# Altium project Jetson AGX Xavier Carrier Board.PrjPcb (part 5 of 8)

## Sheet JETSON AGX SDIO-SPI-UART-CAN-GPIO.SchDoc: Jetson AGX SDIO-SPI-UART-CAN-GPIO
size 431 x 279 mm; CheckedBy: Lance Bantoto; Engineer: Cindy Li, Chealsie Bains; DocumentNumber: 7; Revision: 1; SheetNumber: 7; SheetTotal: 23
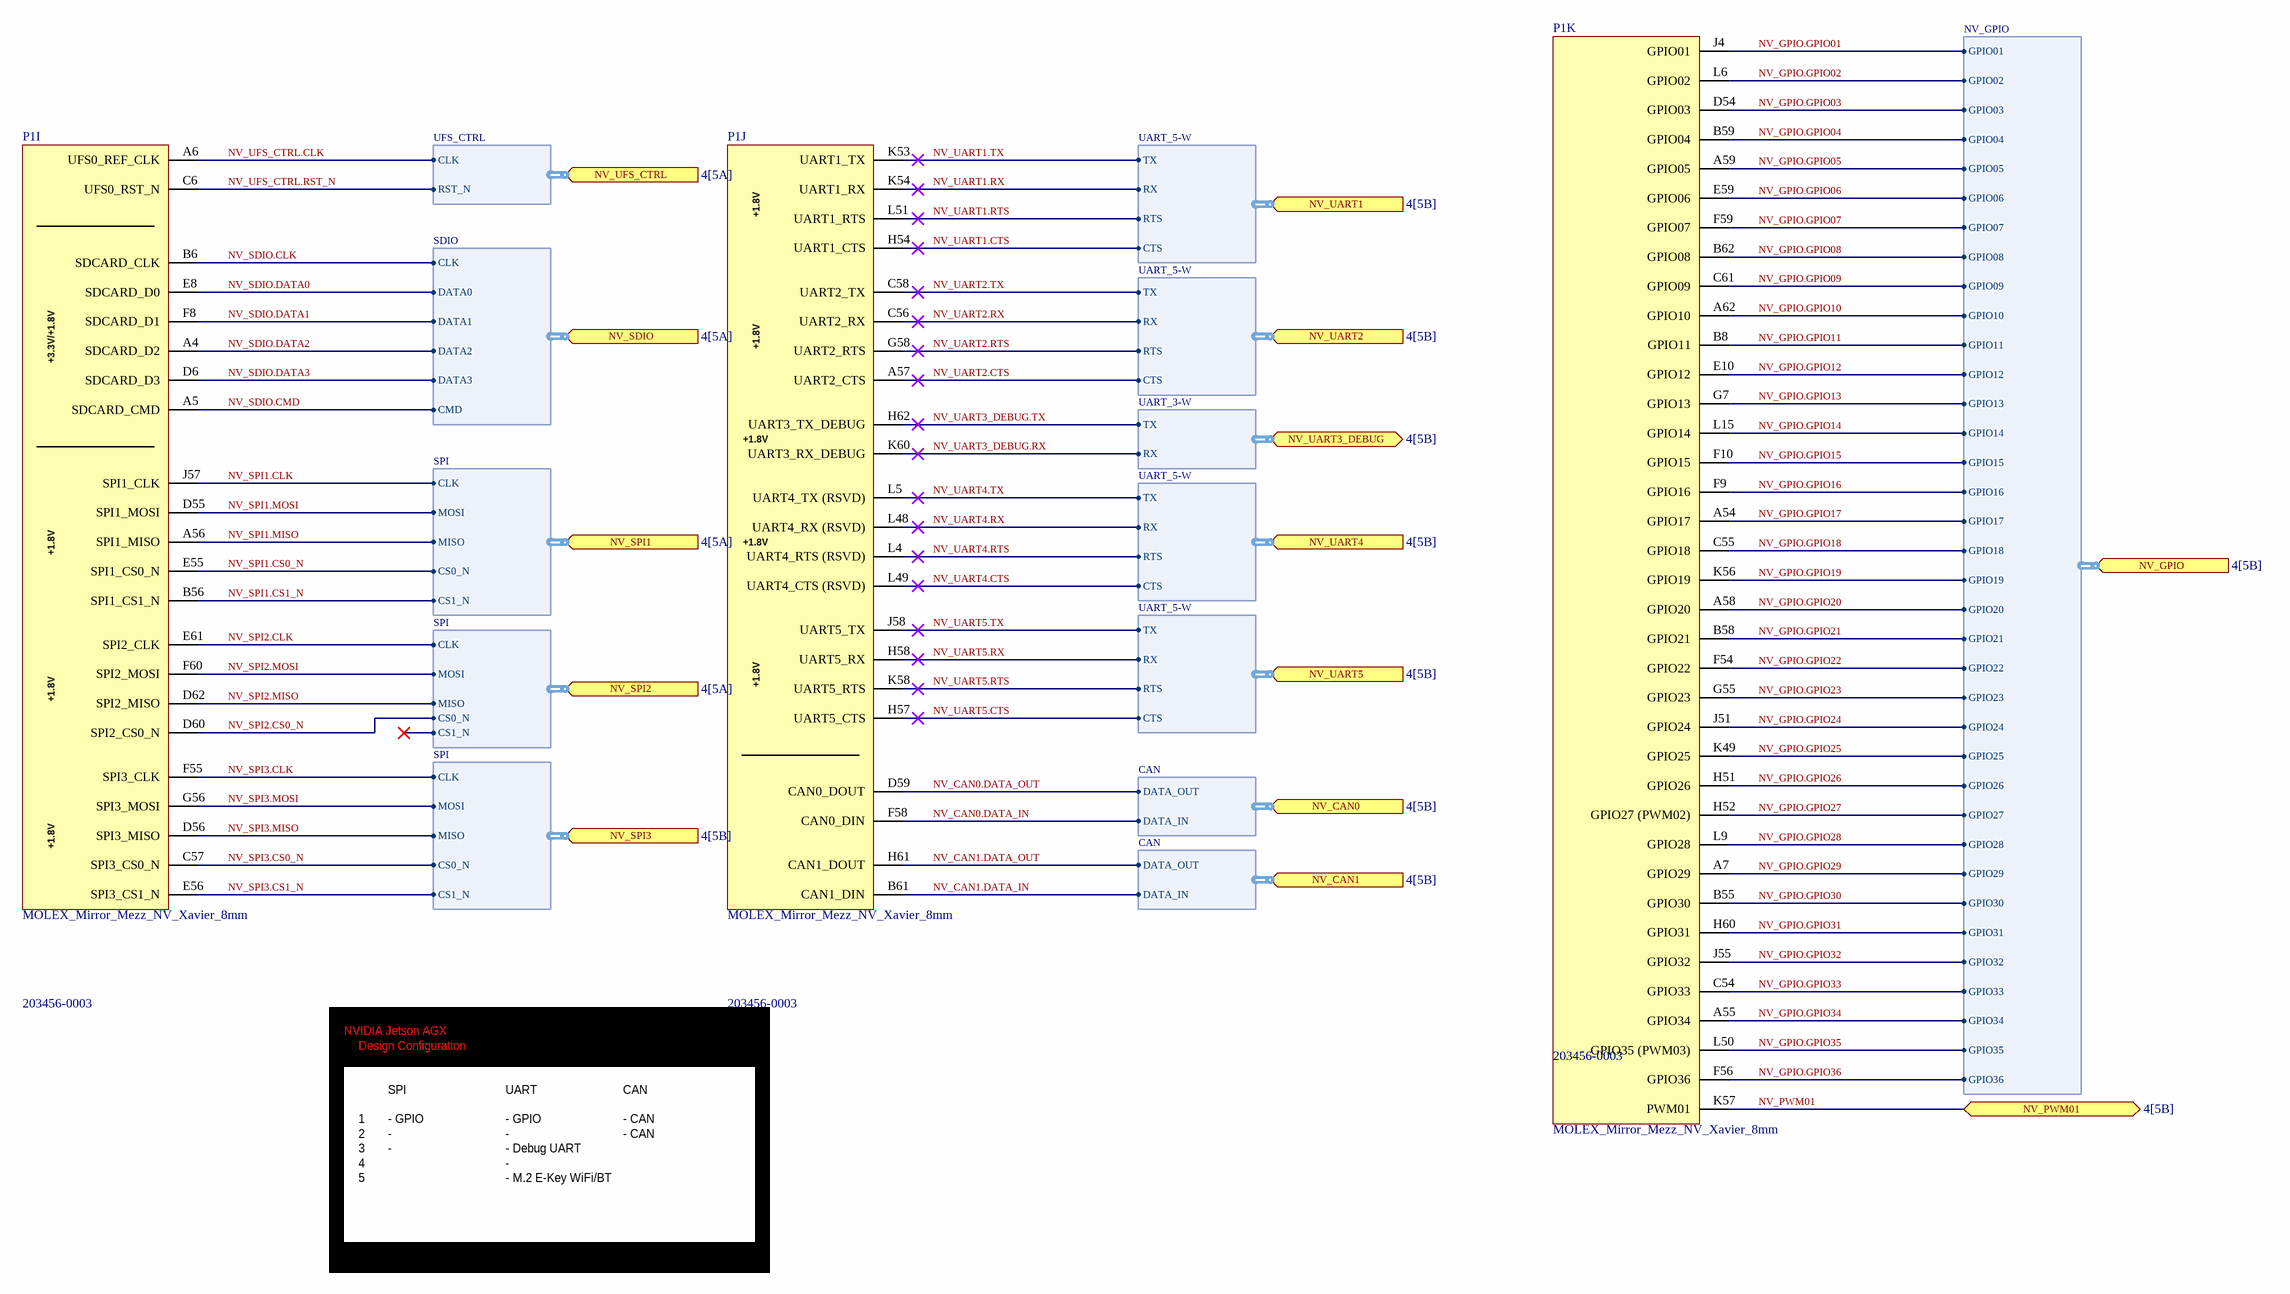
[diagram p14: JETSON AGX SDIO-SPI-UART-CAN-GPIO.SchDoc]

### Parts
P1  MOLEX_Mirror_Mezz_NV_Xavier_8mm  [203456-0003]  (parts I,J,K of 15)

### Ports
NV_CAN0 (in, harness CAN, see 4[5B]), NV_CAN1 (in, harness CAN, see 4[5B]), NV_GPIO (in, harness NV_GPIO, see 4[5B]), NV_PWM01 (bidir, see 4[5B]), NV_SDIO (in, harness SDIO, see 4[5A]), NV_SPI1 (in, harness SPI, see 4[5A]), NV_SPI2 (in, harness SPI, see 4[5A]), NV_SPI3 (in, harness SPI, see 4[5B]), NV_UART1 (in, harness UART_5-W, see 4[5B]), NV_UART2 (in, harness UART_5-W, see 4[5B]), NV_UART3_DEBUG (bidir, harness UART_3-W, see 4[5B]), NV_UART4 (in, harness UART_5-W, see 4[5B]), NV_UART5 (in, harness UART_5-W, see 4[5B]), NV_UFS_CTRL (in, harness UFS_CTRL, see 4[5A])

### Harnesses
SDIO: CLK, DATA0, DATA1, DATA2, DATA3, CMD
SPI: CLK, MOSI, MISO, CS0_N, CS1_N
UFS_CTRL: CLK, RST_N
UART_5-W: TX, RX, RTS, CTS
UART_3-W: TX, RX
CAN: DATA_OUT, DATA_IN
NV_GPIO: GPIO01, GPIO02, GPIO03, GPIO04, GPIO05, GPIO06, GPIO07, GPIO08, GPIO09, GPIO10, GPIO11, GPIO12, GPIO13, GPIO14, GPIO15, GPIO16, GPIO17, GPIO18, GPIO19, GPIO20, GPIO21, GPIO22, GPIO23, GPIO24, GPIO25, GPIO26, GPIO27, GPIO28, GPIO29, GPIO30, GPIO31, GPIO32, GPIO33, GPIO34, GPIO35, GPIO36

### Nets
NV_CAN0.DATA_IN: P1.F58(CAN0_DIN) ; port NV_CAN0.DATA_IN
NV_CAN0.DATA_OUT: P1.D59(CAN0_DOUT) ; port NV_CAN0.DATA_OUT
NV_CAN1.DATA_IN: P1.B61(CAN1_DIN) ; port NV_CAN1.DATA_IN
NV_CAN1.DATA_OUT: P1.H61(CAN1_DOUT) ; port NV_CAN1.DATA_OUT
NV_GPIO.GPIO01: P1.J4(GPIO01) ; port NV_GPIO.GPIO01
NV_GPIO.GPIO02: P1.L6(GPIO02) ; port NV_GPIO.GPIO02
NV_GPIO.GPIO03: P1.D54(GPIO03) ; port NV_GPIO.GPIO03
NV_GPIO.GPIO04: P1.B59(GPIO04) ; port NV_GPIO.GPIO04
NV_GPIO.GPIO05: P1.A59(GPIO05) ; port NV_GPIO.GPIO05
NV_GPIO.GPIO06: P1.E59(GPIO06) ; port NV_GPIO.GPIO06
NV_GPIO.GPIO07: P1.F59(GPIO07) ; port NV_GPIO.GPIO07
NV_GPIO.GPIO08: P1.B62(GPIO08) ; port NV_GPIO.GPIO08
NV_GPIO.GPIO09: P1.C61(GPIO09) ; port NV_GPIO.GPIO09
NV_GPIO.GPIO10: P1.A62(GPIO10) ; port NV_GPIO.GPIO10
NV_GPIO.GPIO11: P1.B8(GPIO11) ; port NV_GPIO.GPIO11
NV_GPIO.GPIO12: P1.E10(GPIO12) ; port NV_GPIO.GPIO12
NV_GPIO.GPIO13: P1.G7(GPIO13) ; port NV_GPIO.GPIO13
NV_GPIO.GPIO14: P1.L15(GPIO14) ; port NV_GPIO.GPIO14
NV_GPIO.GPIO15: P1.F10(GPIO15) ; port NV_GPIO.GPIO15
NV_GPIO.GPIO16: P1.F9(GPIO16) ; port NV_GPIO.GPIO16
NV_GPIO.GPIO17: P1.A54(GPIO17) ; port NV_GPIO.GPIO17
NV_GPIO.GPIO18: P1.C55(GPIO18) ; port NV_GPIO.GPIO18
NV_GPIO.GPIO19: P1.K56(GPIO19) ; port NV_GPIO.GPIO19
NV_GPIO.GPIO20: P1.A58(GPIO20) ; port NV_GPIO.GPIO20
NV_GPIO.GPIO21: P1.B58(GPIO21) ; port NV_GPIO.GPIO21
NV_GPIO.GPIO22: P1.F54(GPIO22) ; port NV_GPIO.GPIO22
NV_GPIO.GPIO23: P1.G55(GPIO23) ; port NV_GPIO.GPIO23
NV_GPIO.GPIO24: P1.J51(GPIO24) ; port NV_GPIO.GPIO24
NV_GPIO.GPIO25: P1.K49(GPIO25) ; port NV_GPIO.GPIO25
NV_GPIO.GPIO26: P1.H51(GPIO26) ; port NV_GPIO.GPIO26
NV_GPIO.GPIO27: P1.H52(GPIO27_(PWM02)) ; port NV_GPIO.GPIO27
NV_GPIO.GPIO28: P1.L9(GPIO28) ; port NV_GPIO.GPIO28
NV_GPIO.GPIO29: P1.A7(GPIO29) ; port NV_GPIO.GPIO29
NV_GPIO.GPIO30: P1.B55(GPIO30) ; port NV_GPIO.GPIO30
NV_GPIO.GPIO31: P1.H60(GPIO31) ; port NV_GPIO.GPIO31
NV_GPIO.GPIO32: P1.J55(GPIO32) ; port NV_GPIO.GPIO32
NV_GPIO.GPIO33: P1.C54(GPIO33) ; port NV_GPIO.GPIO33
NV_GPIO.GPIO34: P1.A55(GPIO34) ; port NV_GPIO.GPIO34
NV_GPIO.GPIO35: P1.L50(GPIO35_(PWM03)) ; port NV_GPIO.GPIO35
NV_GPIO.GPIO36: P1.F56(GPIO36) ; port NV_GPIO.GPIO36
NV_PWM01: P1.K57(PWM01) ; port NV_PWM01
NV_SDIO.CLK: P1.B6(SDCARD_CLK) ; port NV_SDIO.CLK
NV_SDIO.CMD: P1.A5(SDCARD_CMD) ; port NV_SDIO.CMD
NV_SDIO.DATA0: P1.E8(SDCARD_D0) ; port NV_SDIO.DATA0
NV_SDIO.DATA1: P1.F8(SDCARD_D1) ; port NV_SDIO.DATA1
NV_SDIO.DATA2: P1.A4(SDCARD_D2) ; port NV_SDIO.DATA2
NV_SDIO.DATA3: P1.D6(SDCARD_D3) ; port NV_SDIO.DATA3
NV_SPI1.CLK: P1.J57(SPI1_CLK) ; port NV_SPI1.CLK
NV_SPI1.CS0_N: P1.E55(SPI1_CS0_N) ; port NV_SPI1.CS0_N
NV_SPI1.CS1_N: P1.B56(SPI1_CS1_N) ; port NV_SPI1.CS1_N
NV_SPI1.MISO: P1.A56(SPI1_MISO) ; port NV_SPI1.MISO
NV_SPI1.MOSI: P1.D55(SPI1_MOSI) ; port NV_SPI1.MOSI
NV_SPI2.CLK: P1.E61(SPI2_CLK) ; port NV_SPI2.CLK
NV_SPI2.CS0_N: P1.D60(SPI2_CS0_N) ; port NV_SPI2.CS0_N
NV_SPI2.MISO: P1.D62(SPI2_MISO) ; port NV_SPI2.MISO
NV_SPI2.MOSI: P1.F60(SPI2_MOSI) ; port NV_SPI2.MOSI
NV_SPI3.CLK: P1.F55(SPI3_CLK) ; port NV_SPI3.CLK
NV_SPI3.CS0_N: P1.C57(SPI3_CS0_N) ; port NV_SPI3.CS0_N
NV_SPI3.CS1_N: P1.E56(SPI3_CS1_N) ; port NV_SPI3.CS1_N
NV_SPI3.MISO: P1.D56(SPI3_MISO) ; port NV_SPI3.MISO
NV_SPI3.MOSI: P1.G56(SPI3_MOSI) ; port NV_SPI3.MOSI
NV_UART1.CTS: P1.H54(UART1_CTS) ; port NV_UART1.CTS
NV_UART1.RTS: P1.L51(UART1_RTS) ; port NV_UART1.RTS
NV_UART1.RX: P1.K54(UART1_RX) ; port NV_UART1.RX
NV_UART1.TX: P1.K53(UART1_TX) ; port NV_UART1.TX
NV_UART2.CTS: P1.A57(UART2_CTS) ; port NV_UART2.CTS
NV_UART2.RTS: P1.G58(UART2_RTS) ; port NV_UART2.RTS
NV_UART2.RX: P1.C56(UART2_RX) ; port NV_UART2.RX
NV_UART2.TX: P1.C58(UART2_TX) ; port NV_UART2.TX
NV_UART3_DEBUG.RX: P1.K60(UART3_RX_DEBUG) ; port NV_UART3_DEBUG.RX
NV_UART3_DEBUG.TX: P1.H62(UART3_TX_DEBUG) ; port NV_UART3_DEBUG.TX
NV_UART4.CTS: P1.L49(UART4_CTS_(RSVD)) ; port NV_UART4.CTS
NV_UART4.RTS: P1.L4(UART4_RTS_(RSVD)) ; port NV_UART4.RTS
NV_UART4.RX: P1.L48(UART4_RX_(RSVD)) ; port NV_UART4.RX
NV_UART4.TX: P1.L5(UART4_TX_(RSVD)) ; port NV_UART4.TX
NV_UART5.CTS: P1.H57(UART5_CTS) ; port NV_UART5.CTS  [project net NV_UART.CTS]
NV_UART5.RTS: P1.K58(UART5_RTS) ; port NV_UART5.RTS
NV_UART5.RX: P1.H58(UART5_RX) ; port NV_UART5.RX
NV_UART5.TX: P1.J58(UART5_TX) ; port NV_UART5.TX
NV_UFS_CTRL.CLK: P1.A6(UFS0_REF_CLK) ; port NV_UFS_CTRL.CLK
NV_UFS_CTRL.RST_N: P1.C6(UFS0_RST_N) ; port NV_UFS_CTRL.RST_N

### Notes on the sheet
- +1.8V
- +3.3V/+1.8V
- NVIDIA Jetson AGX
- Design Configuration
- SPI
- UART
- CAN
- - CAN
  - CAN
- 1
  2
  3
  4
  5
- - GPIO
  -
  -
- - GPIO
  -
  - Debug UART
  -
  - M.2 E-Key WiFi/BT
- University of Waterloo Robotics Team
- 200 University Ave W
- REV
- PROJECT
- Waterloo, Ontario, Canada
- N2L 3G1
- DOCUMENT
- ENGINEER
- REVIEWER
- MODIFIED
- SHEET
- OF

### Library data of the parts
P1 = MOLEX_Mirror_Mezz_NV_Xavier_8mm: CONN SELF-MATE 699POS SMD GOLD; Manufacturer 1: Molex; Supplier 1: Digi-Key; Supplier Part Number 1: WM25528CT-ND; Manufacturer Part Number 1: 203456-0003

## Sheet JETSON AGX SYS-PWR-GND.SchDoc: Jetson AGX SYS-PWR-GND
size 431 x 279 mm; CheckedBy: Lance Bantoto; Engineer: Cindy Li, Chealsie Bains; DocumentNumber: 6; Revision: 1; SheetNumber: 6; SheetTotal: 23
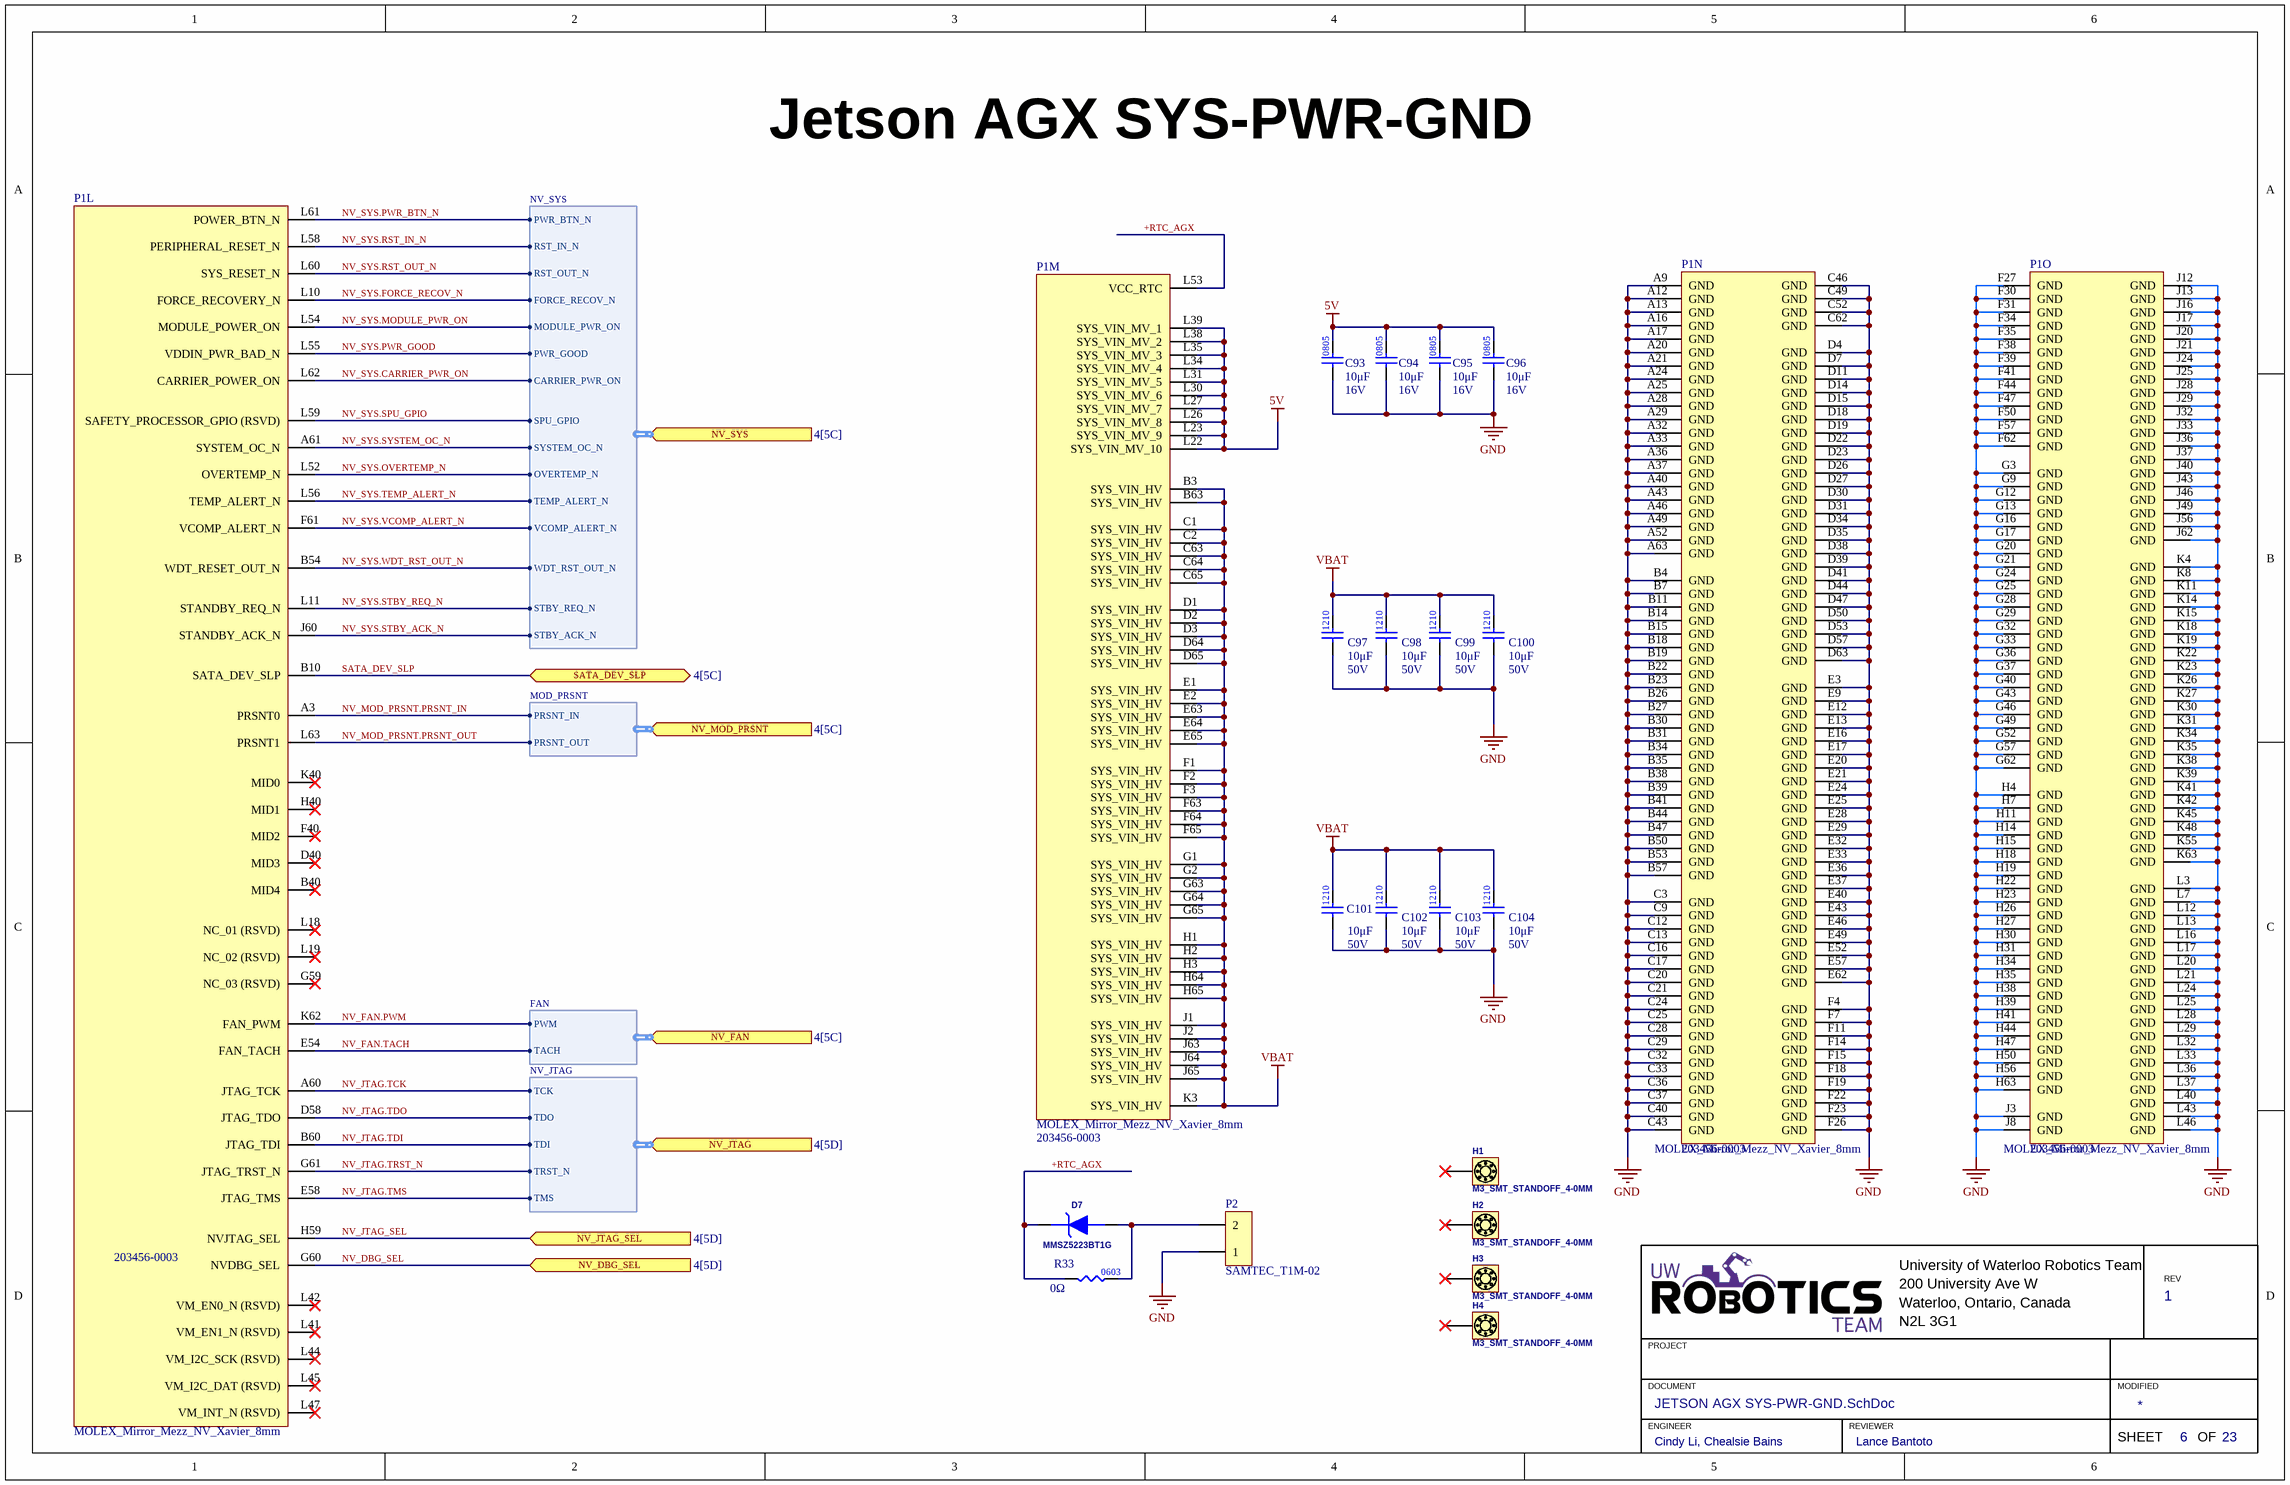
[diagram p15: JETSON AGX SYS-PWR-GND.SchDoc]

### Parts
C93  value 10μF  Voltage Rating: 16V  [CAP2012]  (hidden comment: CAP_10uF_16V_0805)
C94  value 10μF  Voltage Rating: 16V  [CAP2012]  (hidden comment: CAP_10uF_16V_0805)
C95  value 10μF  Voltage Rating: 16V  [CAP2012]  (hidden comment: CAP_10uF_16V_0805)
C96  value 10μF  Voltage Rating: 16V  [CAP2012]  (hidden comment: CAP_10uF_16V_0805)
C97  value 10μF  Voltage Rating: 50V  [CAP1210]  (hidden comment: CAP_10uF_50V_1210)
C98  value 10μF  Voltage Rating: 50V  [CAP1210]  (hidden comment: CAP_10uF_50V_1210)
C99  value 10μF  Voltage Rating: 50V  [CAP1210]  (hidden comment: CAP_10uF_50V_1210)
C100  value 10μF  Voltage Rating: 50V  [CAP1210]  (hidden comment: CAP_10uF_50V_1210)
C101  value 10μF  Voltage Rating: 50V  [CAP1210]  (hidden comment: CAP_10uF_50V_1210)
C102  value 10μF  Voltage Rating: 50V  [CAP1210]  (hidden comment: CAP_10uF_50V_1210)
C103  value 10μF  Voltage Rating: 50V  [CAP1210]  (hidden comment: CAP_10uF_50V_1210)
C104  value 10μF  Voltage Rating: 50V  [CAP1210]  (hidden comment: CAP_10uF_50V_1210)
D7  MMSZ5223BT1G  [ON SEMI SOD-123]
H1  M3_SMT_STANDOFF_4-0MM  [M3_SMT_4-0MM]
H2  M3_SMT_STANDOFF_4-0MM  [M3_SMT_4-0MM]
H3  M3_SMT_STANDOFF_4-0MM  [M3_SMT_4-0MM]
H4  M3_SMT_STANDOFF_4-0MM  [M3_SMT_4-0MM]
P1  MOLEX_Mirror_Mezz_NV_Xavier_8mm  [203456-0003]  (parts L,M,N,O of 15)
P2  SAMTEC_T1M-02  [T1M-02-F-SV-L]
R33  value 0Ω  [RES0603]  (hidden comment: RES_0Ω_0603)

### Ports
NV_DBG_SEL (in, see 4[5D]), NV_FAN (in, harness FAN, see 4[5C]), NV_JTAG (in, harness NV_JTAG, see 4[5D]), NV_JTAG_SEL (in, see 4[5D]), NV_MOD_PRSNT (in, harness MOD_PRSNT, see 4[5C]), NV_SYS (in, harness NV_SYS, see 4[5C]), SATA_DEV_SLP (bidir, see 4[5C])

### Harnesses
NV_JTAG: TCK, TDI, TDO, TMS, TRST_N
FAN: TACH, PWM
NV_SYS: PWR_BTN_N, RST_IN_N, RST_OUT_N, FORCE_RECOV_N, MODULE_PWR_ON, PWR_GOOD, CARRIER_PWR_ON, SPU_GPIO, SYSTEM_OC_N, OVERTEMP_N, TEMP_ALERT_N, VCOMP_ALERT_N, WDT_RST_OUT_N, STBY_REQ_N, STBY_ACK_N
MOD_PRSNT: PRSNT_IN, PRSNT_OUT

### Nets
5V: C93.2 C94.2 C95.2 C96.2 P1.L22(SYS_VIN_MV_10) P1.L23(SYS_VIN_MV_9) P1.L26(SYS_VIN_MV_8) P1.L27(SYS_VIN_MV_7) P1.L30(SYS_VIN_MV_6) P1.L31(SYS_VIN_MV_5) P1.L34(SYS_VIN_MV_4) P1.L35(SYS_VIN_MV_3) P1.L38(SYS_VIN_MV_2) P1.L39(SYS_VIN_MV_1)
GND: C93.1 C94.1 C95.1 C96.1 C97.1 C98.1 C99.1 C100.1 C101.1 C102.1 C103.1 C104.1 P1.A3(PRSNT0) P1.A9(GND) P1.A12(GND) P1.A13(GND) P1.A16(GND) P1.A17(GND) P1.A20(GND) P1.A21(GND) P1.A24(GND) P1.A25(GND) P1.A28(GND) P1.A29(GND) P1.A32(GND) P1.A33(GND) P1.A36(GND) P1.A37(GND) P1.A40(GND) P1.A43(GND) P1.A46(GND) P1.A49(GND) P1.A52(GND) P1.A63(GND) P1.B4(GND) P1.B7(GND) P1.B11(GND) P1.B14(GND) P1.B15(GND) P1.B18(GND) P1.B19(GND) P1.B22(GND) P1.B23(GND) P1.B26(GND) P1.B27(GND) P1.B30(GND) P1.B31(GND) P1.B34(GND) P1.B35(GND) P1.B38(GND) P1.B39(GND) P1.B41(GND) P1.B44(GND) P1.B47(GND) P1.B50(GND) P1.B53(GND) P1.B57(GND) P1.C3(GND) P1.C9(GND) P1.C12(GND) P1.C13(GND) P1.C16(GND) P1.C17(GND) P1.C20(GND) P1.C21(GND) P1.C24(GND) P1.C25(GND) P1.C28(GND) P1.C29(GND) P1.C32(GND) P1.C33(GND) P1.C36(GND) P1.C37(GND) P1.C40(GND) P1.C43(GND) P1.C46(GND) P1.C49(GND) P1.C52(GND) P1.C62(GND) P1.D4(GND) P1.D7(GND) P1.D11(GND) P1.D14(GND) P1.D15(GND) P1.D18(GND) P1.D19(GND) P1.D22(GND) P1.D23(GND) P1.D26(GND) P1.D27(GND) P1.D30(GND) P1.D31(GND) P1.D34(GND) P1.D35(GND) P1.D38(GND) P1.D39(GND) P1.D41(GND) P1.D44(GND) P1.D47(GND) P1.D50(GND) P1.D53(GND) P1.D57(GND) P1.D63(GND) P1.E3(GND) P1.E9(GND) P1.E12(GND) P1.E13(GND) P1.E16(GND) P1.E17(GND) P1.E20(GND) P1.E21(GND) P1.E24(GND) P1.E25(GND) P1.E28(GND) P1.E29(GND) P1.E32(GND) P1.E33(GND) P1.E36(GND) P1.E37(GND) P1.E40(GND) P1.E43(GND) P1.E46(GND) P1.E49(GND) P1.E52(GND) P1.E57(GND) P1.E62(GND) P1.F4(GND) P1.F7(GND) P1.F11(GND) P1.F14(GND) P1.F15(GND) P1.F18(GND) P1.F19(GND) P1.F22(GND) P1.F23(GND) P1.F26(GND) P1.F27(GND) P1.F30(GND) P1.F31(GND) P1.F34(GND) P1.F35(GND) P1.F38(GND) P1.F39(GND) P1.F41(GND) P1.F44(GND) P1.F47(GND) P1.F50(GND) P1.F57(GND) P1.F62(GND) P1.G3(GND) P1.G9(GND) P1.G12(GND) P1.G13(GND) P1.G16(GND) P1.G17(GND) P1.G20(GND) P1.G21(GND) P1.G24(GND) P1.G25(GND) P1.G28(GND) P1.G29(GND) P1.G32(GND) P1.G33(GND) P1.G36(GND) P1.G37(GND) P1.G40(GND) P1.G43(GND) P1.G46(GND) P1.G49(GND) P1.G52(GND) P1.G57(GND) P1.G62(GND) P1.H4(GND) P1.H7(GND) P1.H11(GND) P1.H14(GND) P1.H15(GND) P1.H18(GND) P1.H19(GND) P1.H22(GND) P1.H23(GND) P1.H26(GND) P1.H27(GND) P1.H30(GND) P1.H31(GND) P1.H34(GND) P1.H35(GND) P1.H38(GND) P1.H39(GND) P1.H41(GND) P1.H44(GND) P1.H47(GND) P1.H50(GND) P1.H56(GND) P1.H63(GND) P1.J3(GND) P1.J8(GND) P1.J12(GND) P1.J13(GND) P1.J16(GND) P1.J17(GND) P1.J20(GND) P1.J21(GND) P1.J24(GND) P1.J25(GND) P1.J28(GND) P1.J29(GND) P1.J32(GND) P1.J33(GND) P1.J36(GND) P1.J37(GND) P1.J40(GND) P1.J43(GND) P1.J46(GND) P1.J49(GND) P1.J56(GND) P1.J62(GND) P1.K4(GND) P1.K8(GND) P1.K11(GND) P1.K14(GND) P1.K15(GND) P1.K18(GND) P1.K19(GND) P1.K22(GND) P1.K23(GND) P1.K26(GND) P1.K27(GND) P1.K30(GND) P1.K31(GND) P1.K34(GND) P1.K35(GND) P1.K38(GND) P1.K39(GND) P1.K41(GND) P1.K42(GND) P1.K45(GND) P1.K48(GND) P1.K55(GND) P1.K63(GND) P1.L3(GND) P1.L7(GND) P1.L12(GND) P1.L13(GND) P1.L16(GND) P1.L17(GND) P1.L20(GND) P1.L21(GND) P1.L24(GND) P1.L25(GND) P1.L28(GND) P1.L29(GND) P1.L32(GND) P1.L33(GND) P1.L36(GND) P1.L37(GND) P1.L40(GND) P1.L43(GND) P1.L46(GND) P2.1 ; port NV_MOD_PRSNT.PRSNT_IN  [also labelled NV_MOD_PRSNT.PRSNT_IN]
VBAT: C97.2 C98.2 C99.2 C100.2 C101.2 C102.2 C103.2 C104.2 P1.B3(SYS_VIN_HV) P1.B63(SYS_VIN_HV) P1.C1(SYS_VIN_HV) P1.C2(SYS_VIN_HV) P1.C63(SYS_VIN_HV) P1.C64(SYS_VIN_HV) P1.C65(SYS_VIN_HV) P1.D1(SYS_VIN_HV) P1.D2(SYS_VIN_HV) P1.D3(SYS_VIN_HV) P1.D64(SYS_VIN_HV) P1.D65(SYS_VIN_HV) P1.E1(SYS_VIN_HV) P1.E2(SYS_VIN_HV) P1.E63(SYS_VIN_HV) P1.E64(SYS_VIN_HV) P1.E65(SYS_VIN_HV) P1.F1(SYS_VIN_HV) P1.F2(SYS_VIN_HV) P1.F3(SYS_VIN_HV) P1.F63(SYS_VIN_HV) P1.F64(SYS_VIN_HV) P1.F65(SYS_VIN_HV) P1.G1(SYS_VIN_HV) P1.G2(SYS_VIN_HV) P1.G63(SYS_VIN_HV) P1.G64(SYS_VIN_HV) P1.G65(SYS_VIN_HV) P1.H1(SYS_VIN_HV) P1.H2(SYS_VIN_HV) P1.H3(SYS_VIN_HV) P1.H64(SYS_VIN_HV) P1.H65(SYS_VIN_HV) P1.J1(SYS_VIN_HV) P1.J2(SYS_VIN_HV) P1.J63(SYS_VIN_HV) P1.J64(SYS_VIN_HV) P1.J65(SYS_VIN_HV) P1.K3(SYS_VIN_HV)
+RTC_AGX: D7.1(C) P1.L53(VCC_RTC) R33.1
NV_DBG_SEL: P1.G60(NVDBG_SEL) ; port NV_DBG_SEL
NV_FAN.PWM: P1.K62(FAN_PWM) ; port NV_FAN.PWM
NV_FAN.TACH: P1.E54(FAN_TACH) ; port NV_FAN.TACH
NV_JTAG.TCK: P1.A60(JTAG_TCK) ; port NV_JTAG.TCK
NV_JTAG.TDI: P1.B60(JTAG_TDI) ; port NV_JTAG.TDI
NV_JTAG.TDO: P1.D58(JTAG_TDO) ; port NV_JTAG.TDO
NV_JTAG.TMS: P1.E58(JTAG_TMS) ; port NV_JTAG.TMS
NV_JTAG.TRST_N: P1.G61(JTAG_TRST_N) ; port NV_JTAG.TRST_N
NV_JTAG_SEL: P1.H59(NVJTAG_SEL) ; port NV_JTAG_SEL
NV_MOD_PRSNT.PRSNT_OUT: P1.L63(PRSNT1) ; port NV_MOD_PRSNT.PRSNT_OUT
NV_SYS.CARRIER_PWR_ON: P1.L62(CARRIER_POWER_ON) ; port NV_SYS.CARRIER_PWR_ON
NV_SYS.FORCE_RECOV_N: P1.L10(FORCE_RECOVERY_N) ; port NV_SYS.FORCE_RECOV_N
NV_SYS.MODULE_PWR_ON: P1.L54(MODULE_POWER_ON) ; port NV_SYS.MODULE_PWR_ON
NV_SYS.OVERTEMP_N: P1.L52(OVERTEMP_N) ; port NV_SYS.OVERTEMP_N
NV_SYS.PWR_BTN_N: P1.L61(POWER_BTN_N) ; port NV_SYS.PWR_BTN_N
NV_SYS.PWR_GOOD: P1.L55(VDDIN_PWR_BAD_N) ; port NV_SYS.PWR_GOOD
NV_SYS.RST_IN_N: P1.L58(PERIPHERAL_RESET_N) ; port NV_SYS.RST_IN_N
NV_SYS.RST_OUT_N: P1.L60(SYS_RESET_N) ; port NV_SYS.RST_OUT_N
NV_SYS.SPU_GPIO: P1.L59(SAFETY_PROCESSOR_GPIO_(RSVD)) ; port NV_SYS.SPU_GPIO
NV_SYS.STBY_ACK_N: P1.J60(STANDBY_ACK_N) ; port NV_SYS.STBY_ACK_N
NV_SYS.STBY_REQ_N: P1.L11(STANDBY_REQ_N) ; port NV_SYS.STBY_REQ_N
NV_SYS.SYSTEM_OC_N: P1.A61(SYSTEM_OC_N) ; port NV_SYS.SYSTEM_OC_N
NV_SYS.TEMP_ALERT_N: P1.L56(TEMP_ALERT_N) ; port NV_SYS.TEMP_ALERT_N
NV_SYS.VCOMP_ALERT_N: P1.F61(VCOMP_ALERT_N) ; port NV_SYS.VCOMP_ALERT_N
NV_SYS.WDT_RST_OUT_N: P1.B54(WDT_RESET_OUT_N) ; port NV_SYS.WDT_RST_OUT_N
SATA_DEV_SLP: P1.B10(SATA_DEV_SLP) ; port SATA_DEV_SLP
NetD7_2: D7.2(A) P2.2 R33.2

Not connected (* = marked no-connect by the designer): H1 0*; H2 0*; H3 0*; H4 0*; P1 B40(MID4)* D40(MID3)* F40(MID2)* G59(NC_03_(RSVD))* H40(MID1)* K40(MID0)* L18(NC_01_(RSVD))* L19(NC_02_(RSVD))* L41(VM_EN1_N_(RSVD))* L42(VM_EN0_N_(RSVD))* L44(VM_I2C_SCK_(RSVD))* L45(VM_I2C_DAT_(RSVD))* L47(VM_INT_N_(RSVD))*

### Notes on the sheet
- University of Waterloo Robotics Team
- 200 University Ave W
- REV
- PROJECT
- Waterloo, Ontario, Canada
- N2L 3G1
- DOCUMENT
- ENGINEER
- REVIEWER
- MODIFIED
- SHEET
- OF
- (in symbol CAP_10uF_50V_1210) 1210

### Library data of the parts
C93-C96 = CAP_10uF_16V_0805: CAP CER 10UF 16V X5R 0805; Manufacturer 1: Yageo; Manufacturer Part Number 1: CC0805KKX5R7BB106; Package/Footprint: 0805; Dielectric: X5R; Supplier 1: Digi-Key; Supplier Part Number 1: 311-1865-1-ND; Mounting Type: SMD
C97-C104 = CAP_10uF_50V_1210: CAP CER 10UF 50V X7R 1210; Manufacturer 1: Murata Electronics; Manufacturer Part Number 1: GRM32ER71H106MA12L; Dielectric: X7R; Supplier 1: Digi-Key; Supplier Part Number 1: 490-12775-1-ND
D7 = MMSZ5223BT1G: DIODE ZENER 2.7V 500MW SOD123; Manufacturer 1: On Semiconductor; Forward Voltage: 900mV @ 10mA; Voltage - Zener: 2.7V; Power - Max: 500mW; Package: SOD-123
H1-H4 = M3_SMT_STANDOFF_4-0MM: ROUND STANDOFF M3X0.5 STEEL 4MM; Manufacturer 1: Würth Elektronik; Manufacturer Part Number 1: 9774040360R; Supplier 1: Digi-Key; Supplier Part Number 1: 732-5271-1-ND
P1 = MOLEX_Mirror_Mezz_NV_Xavier_8mm: as P1 on sheet JETSON AGX SDIO-SPI-UART-CAN-GPIO; Supplier 1: Digi-Key; Supplier Part Number 1: WM25528CT-ND; Manufacturer Part Number 1: 203456-0003
P2 = SAMTEC_T1M-02-F-SV-L: CONN HEADER SMD 2POS 1MM; Manufacturer 1: Samtec; Manufacturer Part Number 1: T1M-02-F-SV-L; Supplier 1: Digi-Key; Supplier Part Number 1: SAM15469CT-ND
R33 = RES_0Ω_0603: RES 0 OHM JUMPER 1/10W 0603; Manufacturer 1: Yageo; Manufacturer Part Number 1: RC0603JR-070RL; Supplier Part Number 1: 311-0.0GRCT-ND; Supplier 1: Digi-Key; Mounting Type: SMD; Package: 0603

## Sheet JETSON AGX UPHY.SchDoc: Jetson AGX - UPHY
size 431 x 279 mm; CheckedBy: Lance Bantoto; Engineer: Cindy Li, Chealsie Bains; DocumentNumber: 9; Revision: 1; SheetNumber: 9; SheetTotal: 23
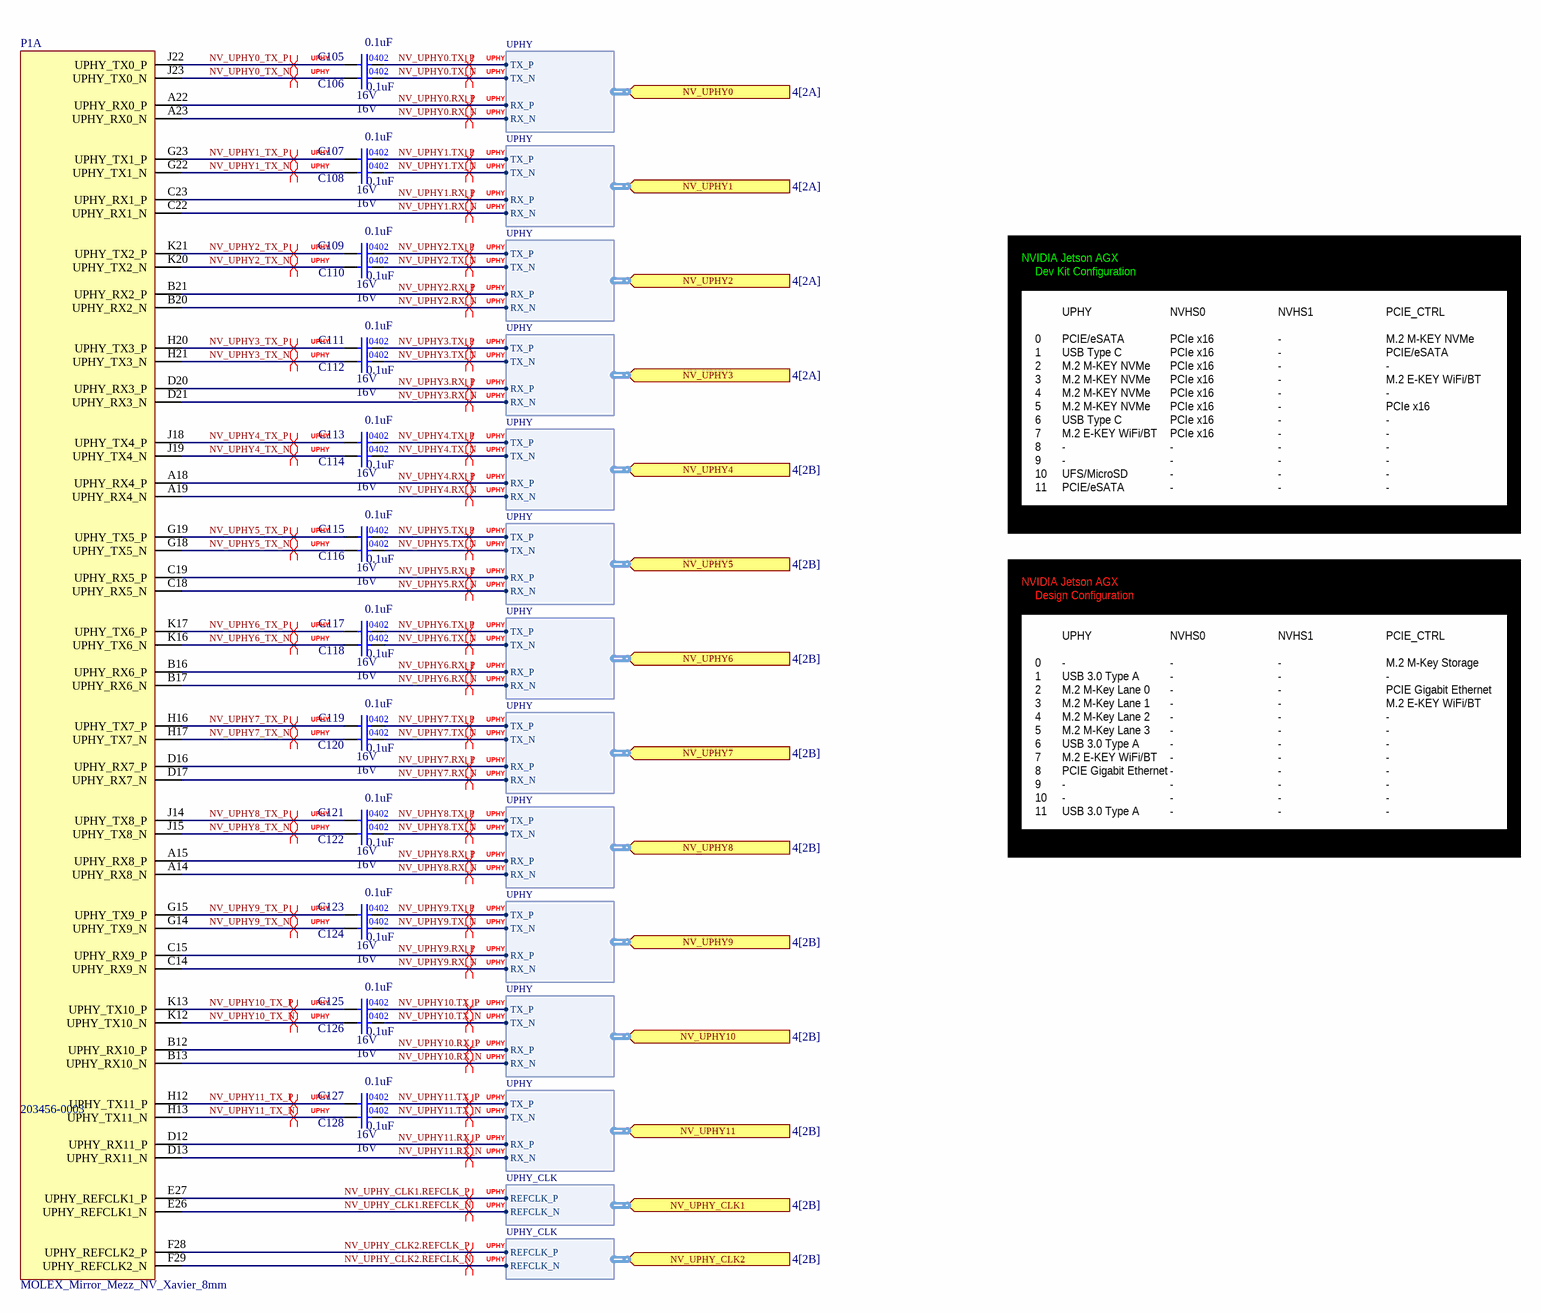
[diagram p16: JETSON AGX UPHY.SchDoc]

### Parts
C105  Capacitance: 0.1uF  Voltage Rating: 16V  [CAP0402]  (hidden comment: CAP_0.1uF_16V_X7R_0402)
C106  Capacitance: 0.1uF  Voltage Rating: 16V  [CAP0402]  (hidden comment: CAP_0.1uF_16V_X7R_0402)
C107  Capacitance: 0.1uF  Voltage Rating: 16V  [CAP0402]  (hidden comment: CAP_0.1uF_16V_X7R_0402)
C108  Capacitance: 0.1uF  Voltage Rating: 16V  [CAP0402]  (hidden comment: CAP_0.1uF_16V_X7R_0402)
C109  Capacitance: 0.1uF  Voltage Rating: 16V  [CAP0402]  (hidden comment: CAP_0.1uF_16V_X7R_0402)
C110  Capacitance: 0.1uF  Voltage Rating: 16V  [CAP0402]  (hidden comment: CAP_0.1uF_16V_X7R_0402)
C111  Capacitance: 0.1uF  Voltage Rating: 16V  [CAP0402]  (hidden comment: CAP_0.1uF_16V_X7R_0402)
C112  Capacitance: 0.1uF  Voltage Rating: 16V  [CAP0402]  (hidden comment: CAP_0.1uF_16V_X7R_0402)
C113  Capacitance: 0.1uF  Voltage Rating: 16V  [CAP0402]  (hidden comment: CAP_0.1uF_16V_X7R_0402)
C114  Capacitance: 0.1uF  Voltage Rating: 16V  [CAP0402]  (hidden comment: CAP_0.1uF_16V_X7R_0402)
C115  Capacitance: 0.1uF  Voltage Rating: 16V  [CAP0402]  (hidden comment: CAP_0.1uF_16V_X7R_0402)
C116  Capacitance: 0.1uF  Voltage Rating: 16V  [CAP0402]  (hidden comment: CAP_0.1uF_16V_X7R_0402)
C117  Capacitance: 0.1uF  Voltage Rating: 16V  [CAP0402]  (hidden comment: CAP_0.1uF_16V_X7R_0402)
C118  Capacitance: 0.1uF  Voltage Rating: 16V  [CAP0402]  (hidden comment: CAP_0.1uF_16V_X7R_0402)
C119  Capacitance: 0.1uF  Voltage Rating: 16V  [CAP0402]  (hidden comment: CAP_0.1uF_16V_X7R_0402)
C120  Capacitance: 0.1uF  Voltage Rating: 16V  [CAP0402]  (hidden comment: CAP_0.1uF_16V_X7R_0402)
C121  Capacitance: 0.1uF  Voltage Rating: 16V  [CAP0402]  (hidden comment: CAP_0.1uF_16V_X7R_0402)
C122  Capacitance: 0.1uF  Voltage Rating: 16V  [CAP0402]  (hidden comment: CAP_0.1uF_16V_X7R_0402)
C123  Capacitance: 0.1uF  Voltage Rating: 16V  [CAP0402]  (hidden comment: CAP_0.1uF_16V_X7R_0402)
C124  Capacitance: 0.1uF  Voltage Rating: 16V  [CAP0402]  (hidden comment: CAP_0.1uF_16V_X7R_0402)
C125  Capacitance: 0.1uF  Voltage Rating: 16V  [CAP0402]  (hidden comment: CAP_0.1uF_16V_X7R_0402)
C126  Capacitance: 0.1uF  Voltage Rating: 16V  [CAP0402]  (hidden comment: CAP_0.1uF_16V_X7R_0402)
C127  Capacitance: 0.1uF  Voltage Rating: 16V  [CAP0402]  (hidden comment: CAP_0.1uF_16V_X7R_0402)
C128  Capacitance: 0.1uF  Voltage Rating: 16V  [CAP0402]  (hidden comment: CAP_0.1uF_16V_X7R_0402)
P1  MOLEX_Mirror_Mezz_NV_Xavier_8mm  [203456-0003]  (part A of 15)

### Ports
NV_UPHY0 (in, harness UPHY, see 4[2A]), NV_UPHY1 (in, harness UPHY, see 4[2A]), NV_UPHY2 (in, harness UPHY, see 4[2A]), NV_UPHY3 (in, harness UPHY, see 4[2A]), NV_UPHY4 (in, harness UPHY, see 4[2B]), NV_UPHY5 (in, harness UPHY, see 4[2B]), NV_UPHY6 (in, harness UPHY, see 4[2B]), NV_UPHY7 (in, harness UPHY, see 4[2B]), NV_UPHY8 (in, harness UPHY, see 4[2B]), NV_UPHY9 (in, harness UPHY, see 4[2B]), NV_UPHY10 (in, harness UPHY, see 4[2B]), NV_UPHY11 (in, harness UPHY, see 4[2B]), NV_UPHY_CLK1 (in, harness UPHY_CLK, see 4[2B]), NV_UPHY_CLK2 (in, harness UPHY_CLK, see 4[2B])

### Harnesses
UPHY: TX_P, TX_N, RX_P, RX_N
UPHY_CLK: REFCLK_P, REFCLK_N

### Nets
NV_UPHY0.RX_N: P1.A23(UPHY_RX0_N) ; port NV_UPHY0.RX_N
NV_UPHY0.RX_P: P1.A22(UPHY_RX0_P) ; port NV_UPHY0.RX_P
NV_UPHY0.TX_N: C106.2 ; port NV_UPHY0.TX_N
NV_UPHY0.TX_P: C105.2 ; port NV_UPHY0.TX_P
NV_UPHY0_TX_N: C106.1 P1.J23(UPHY_TX0_N)
NV_UPHY0_TX_P: C105.1 P1.J22(UPHY_TX0_P)
NV_UPHY1.RX_N: P1.C22(UPHY_RX1_N) ; port NV_UPHY1.RX_N
NV_UPHY1.RX_P: P1.C23(UPHY_RX1_P) ; port NV_UPHY1.RX_P
NV_UPHY1.TX_N: C108.2 ; port NV_UPHY1.TX_N
NV_UPHY1.TX_P: C107.2 ; port NV_UPHY1.TX_P
NV_UPHY1_TX_N: C108.1 P1.G22(UPHY_TX1_N)
NV_UPHY1_TX_P: C107.1 P1.G23(UPHY_TX1_P)
NV_UPHY2.RX_N: P1.B20(UPHY_RX2_N) ; port NV_UPHY2.RX_N
NV_UPHY2.RX_P: P1.B21(UPHY_RX2_P) ; port NV_UPHY2.RX_P
NV_UPHY2.TX_N: C110.2 ; port NV_UPHY2.TX_N
NV_UPHY2.TX_P: C109.2 ; port NV_UPHY2.TX_P
NV_UPHY2_TX_N: C110.1 P1.K20(UPHY_TX2_N)
NV_UPHY2_TX_P: C109.1 P1.K21(UPHY_TX2_P)
NV_UPHY3.RX_N: P1.D21(UPHY_RX3_N) ; port NV_UPHY3.RX_N
NV_UPHY3.RX_P: P1.D20(UPHY_RX3_P) ; port NV_UPHY3.RX_P
NV_UPHY3.TX_N: C112.2 ; port NV_UPHY3.TX_N
NV_UPHY3.TX_P: C111.2 ; port NV_UPHY3.TX_P
NV_UPHY3_TX_N: C112.1 P1.H21(UPHY_TX3_N)
NV_UPHY3_TX_P: C111.1 P1.H20(UPHY_TX3_P)
NV_UPHY4.RX_N: P1.A19(UPHY_RX4_N) ; port NV_UPHY4.RX_N
NV_UPHY4.RX_P: P1.A18(UPHY_RX4_P) ; port NV_UPHY4.RX_P
NV_UPHY4.TX_N: C114.2 ; port NV_UPHY4.TX_N
NV_UPHY4.TX_P: C113.2 ; port NV_UPHY4.TX_P
NV_UPHY4_TX_N: C114.1 P1.J19(UPHY_TX4_N)
NV_UPHY4_TX_P: C113.1 P1.J18(UPHY_TX4_P)
NV_UPHY5.RX_N: P1.C18(UPHY_RX5_N) ; port NV_UPHY5.RX_N
NV_UPHY5.RX_P: P1.C19(UPHY_RX5_P) ; port NV_UPHY5.RX_P
NV_UPHY5.TX_N: C116.2 ; port NV_UPHY5.TX_N
NV_UPHY5.TX_P: C115.2 ; port NV_UPHY5.TX_P
NV_UPHY5_TX_N: C116.1 P1.G18(UPHY_TX5_N)
NV_UPHY5_TX_P: C115.1 P1.G19(UPHY_TX5_P)
NV_UPHY6.RX_N: P1.B17(UPHY_RX6_N) ; port NV_UPHY6.RX_N
NV_UPHY6.RX_P: P1.B16(UPHY_RX6_P) ; port NV_UPHY6.RX_P
NV_UPHY6.TX_N: C118.2 ; port NV_UPHY6.TX_N
NV_UPHY6.TX_P: C117.2 ; port NV_UPHY6.TX_P
NV_UPHY6_TX_N: C118.1 P1.K16(UPHY_TX6_N)
NV_UPHY6_TX_P: C117.1 P1.K17(UPHY_TX6_P)
NV_UPHY7.RX_N: P1.D17(UPHY_RX7_N) ; port NV_UPHY7.RX_N
NV_UPHY7.RX_P: P1.D16(UPHY_RX7_P) ; port NV_UPHY7.RX_P
NV_UPHY7.TX_N: C120.2 ; port NV_UPHY7.TX_N
NV_UPHY7.TX_P: C119.2 ; port NV_UPHY7.TX_P
NV_UPHY7_TX_N: C120.1 P1.H17(UPHY_TX7_N)
NV_UPHY7_TX_P: C119.1 P1.H16(UPHY_TX7_P)
NV_UPHY8.RX_N: P1.A14(UPHY_RX8_N) ; port NV_UPHY8.RX_N
NV_UPHY8.RX_P: P1.A15(UPHY_RX8_P) ; port NV_UPHY8.RX_P
NV_UPHY8.TX_N: C122.2 ; port NV_UPHY8.TX_N
NV_UPHY8.TX_P: C121.2 ; port NV_UPHY8.TX_P
NV_UPHY8_TX_N: C122.1 P1.J15(UPHY_TX8_N)
NV_UPHY8_TX_P: C121.1 P1.J14(UPHY_TX8_P)
NV_UPHY9.RX_N: P1.C14(UPHY_RX9_N) ; port NV_UPHY9.RX_N
NV_UPHY9.RX_P: P1.C15(UPHY_RX9_P) ; port NV_UPHY9.RX_P
NV_UPHY9.TX_N: C124.2 ; port NV_UPHY9.TX_N
NV_UPHY9.TX_P: C123.2 ; port NV_UPHY9.TX_P
NV_UPHY9_TX_N: C124.1 P1.G14(UPHY_TX9_N)
NV_UPHY9_TX_P: C123.1 P1.G15(UPHY_TX9_P)
NV_UPHY10.RX_N: P1.B13(UPHY_RX10_N) ; port NV_UPHY10.RX_N
NV_UPHY10.RX_P: P1.B12(UPHY_RX10_P) ; port NV_UPHY10.RX_P
NV_UPHY10.TX_N: C126.2 ; port NV_UPHY10.TX_N
NV_UPHY10.TX_P: C125.2 ; port NV_UPHY10.TX_P
NV_UPHY10_TX_N: C126.1 P1.K12(UPHY_TX10_N)
NV_UPHY10_TX_P: C125.1 P1.K13(UPHY_TX10_P)
NV_UPHY11.RX_N: P1.D13(UPHY_RX11_N) ; port NV_UPHY11.RX_N
NV_UPHY11.RX_P: P1.D12(UPHY_RX11_P) ; port NV_UPHY11.RX_P
NV_UPHY11.TX_N: C128.2 ; port NV_UPHY11.TX_N
NV_UPHY11.TX_P: C127.2 ; port NV_UPHY11.TX_P
NV_UPHY11_TX_N: C128.1 P1.H13(UPHY_TX11_N)
NV_UPHY11_TX_P: C127.1 P1.H12(UPHY_TX11_P)
NV_UPHY_CLK1.REFCLK_N: P1.E26(UPHY_REFCLK1_N) ; port NV_UPHY_CLK1.REFCLK_N
NV_UPHY_CLK1.REFCLK_P: P1.E27(UPHY_REFCLK1_P) ; port NV_UPHY_CLK1.REFCLK_P
NV_UPHY_CLK2.REFCLK_N: P1.F29(UPHY_REFCLK2_N) ; port NV_UPHY_CLK2.REFCLK_N
NV_UPHY_CLK2.REFCLK_P: P1.F28(UPHY_REFCLK2_P) ; port NV_UPHY_CLK2.REFCLK_P

### Layout directives
differential pair; differential pair class UPHY_CLK; differential pair class UPHY_CLK1: NV_UPHY_CLK1.REFCLK_N, NV_UPHY_CLK1.REFCLK_P
differential pair; differential pair class UPHY_CLK; differential pair class UPHY_CLK2: NV_UPHY_CLK2.REFCLK_N, NV_UPHY_CLK2.REFCLK_P
differential pair; differential pair class UPHY; differential pair class UPHY0: NV_UPHY0.RX_N, NV_UPHY0.RX_P, NV_UPHY0.TX_N, NV_UPHY0.TX_P, NV_UPHY0_TX_N, NV_UPHY0_TX_P
differential pair; differential pair class UPHY; differential pair class UPHY1: NV_UPHY1.RX_N, NV_UPHY1.RX_P, NV_UPHY1.TX_N, NV_UPHY1.TX_P, NV_UPHY1_TX_N, NV_UPHY1_TX_P
differential pair; differential pair class UPHY; differential pair class UPHY2: NV_UPHY2.RX_N, NV_UPHY2.RX_P, NV_UPHY2.TX_N, NV_UPHY2.TX_P, NV_UPHY2_TX_N, NV_UPHY2_TX_P
differential pair; differential pair class UPHY; differential pair class UPHY3: NV_UPHY3.RX_N, NV_UPHY3.RX_P, NV_UPHY3.TX_N, NV_UPHY3.TX_P, NV_UPHY3_TX_N, NV_UPHY3_TX_P
differential pair; differential pair class UPHY; differential pair class UPHY4: NV_UPHY4.RX_N, NV_UPHY4.RX_P, NV_UPHY4.TX_N, NV_UPHY4.TX_P, NV_UPHY4_TX_N, NV_UPHY4_TX_P
differential pair; differential pair class UPHY; differential pair class UPHY5: NV_UPHY5.RX_N, NV_UPHY5.RX_P, NV_UPHY5.TX_N, NV_UPHY5.TX_P, NV_UPHY5_TX_N, NV_UPHY5_TX_P
differential pair; differential pair class UPHY; differential pair class UPHY6: NV_UPHY6.RX_N, NV_UPHY6.RX_P, NV_UPHY6.TX_N, NV_UPHY6.TX_P, NV_UPHY6_TX_N, NV_UPHY6_TX_P
differential pair; differential pair class UPHY; differential pair class UPHY7: NV_UPHY7.RX_N, NV_UPHY7.RX_P, NV_UPHY7.TX_N, NV_UPHY7.TX_P, NV_UPHY7_TX_N, NV_UPHY7_TX_P
differential pair; differential pair class UPHY; differential pair class UPHY8: NV_UPHY8.RX_N, NV_UPHY8.RX_P, NV_UPHY8.TX_N, NV_UPHY8.TX_P, NV_UPHY8_TX_N, NV_UPHY8_TX_P
differential pair; differential pair class UPHY; differential pair class UPHY9: NV_UPHY9.RX_N, NV_UPHY9.RX_P, NV_UPHY9.TX_N, NV_UPHY9.TX_P, NV_UPHY9_TX_N, NV_UPHY9_TX_P
differential pair; differential pair class UPHY; differential pair class UPHY10: NV_UPHY10.RX_N, NV_UPHY10.RX_P, NV_UPHY10.TX_N, NV_UPHY10.TX_P, NV_UPHY10_TX_N, NV_UPHY10_TX_P
differential pair; differential pair class UPHY; differential pair class UPHY11: NV_UPHY11.RX_N, NV_UPHY11.RX_P, NV_UPHY11.TX_N, NV_UPHY11.TX_P, NV_UPHY11_TX_N, NV_UPHY11_TX_P

### Notes on the sheet
- NVIDIA Jetson AGX
- Dev Kit Configuration
- UPHY
- NVHS0
- NVHS1
- PCIE_CTRL
- 0
  1
  2
  3
  4
  5
  6
  7
  8
  9
  10
  11
- PCIE/eSATA
  USB Type C
  M.2 M-KEY NVMe
  M.2 M-KEY NVMe
  M.2 M-KEY NVMe
  M.2 M-KEY NVMe
  USB Type C
  M.2 E-KEY WiFi/BT
  -
  -
  UFS/MicroSD
  PCIE/eSATA
- PCIe x16
  PCIe x16
  PCIe x16
  PCIe x16
  PCIe x16
  PCIe x16
  PCIe x16
  PCIe x16
  -
  -
  -
  -
- -
  -
  -
  -
  -
  -
  -
  -
  -
  -
  -
  -
- M.2 M-KEY NVMe
  PCIE/eSATA
  -
  M.2 E-KEY WiFi/BT
  -
  PCIe x16
  -
  -
  -
  -
  -
  -
  -
- Design Configuration
- -
  USB 3.0 Type A
  M.2 M-Key Lane 0
  M.2 M-Key Lane 1
  M.2 M-Key Lane 2
  M.2 M-Key Lane 3
  USB 3.0 Type A
  M.2 E-KEY WiFi/BT
  PCIE Gigabit Ethernet
  -
  -
  USB 3.0 Type A
- M.2 M-Key Storage
  -
  PCIE Gigabit Ethernet
  M.2 E-KEY WiFi/BT
  -
  -
  -
  -
  -
  -
  -
  -
- University of Waterloo Robotics Team
- 200 University Ave W
- REV
- PROJECT
- Waterloo, Ontario, Canada
- N2L 3G1
- DOCUMENT
- ENGINEER
- REVIEWER
- MODIFIED
- SHEET
- OF

### Library data of the parts
C105-C128 = CAP_0.1uF_16V_X7R_0402: CAP CER 0.1UF 16V X7R 0402; Supplier 1: Digi-Key; Mounting Type: Surface Mount; Package: 0402
P1 = MOLEX_Mirror_Mezz_NV_Xavier_8mm: as P1 on sheet JETSON AGX SDIO-SPI-UART-CAN-GPIO; Supplier 1: Digi-Key; Supplier Part Number 1: WM25528CT-ND; Manufacturer Part Number 1: 203456-0003

## Sheet JETSON AGX NVHS.SchDoc: Jetson AGX -NVHS
size 431 x 279 mm; CheckedBy: Lance Bantoto; DocumentNumber: 5; Revision: 1; SheetNumber: 5; SheetTotal: 23
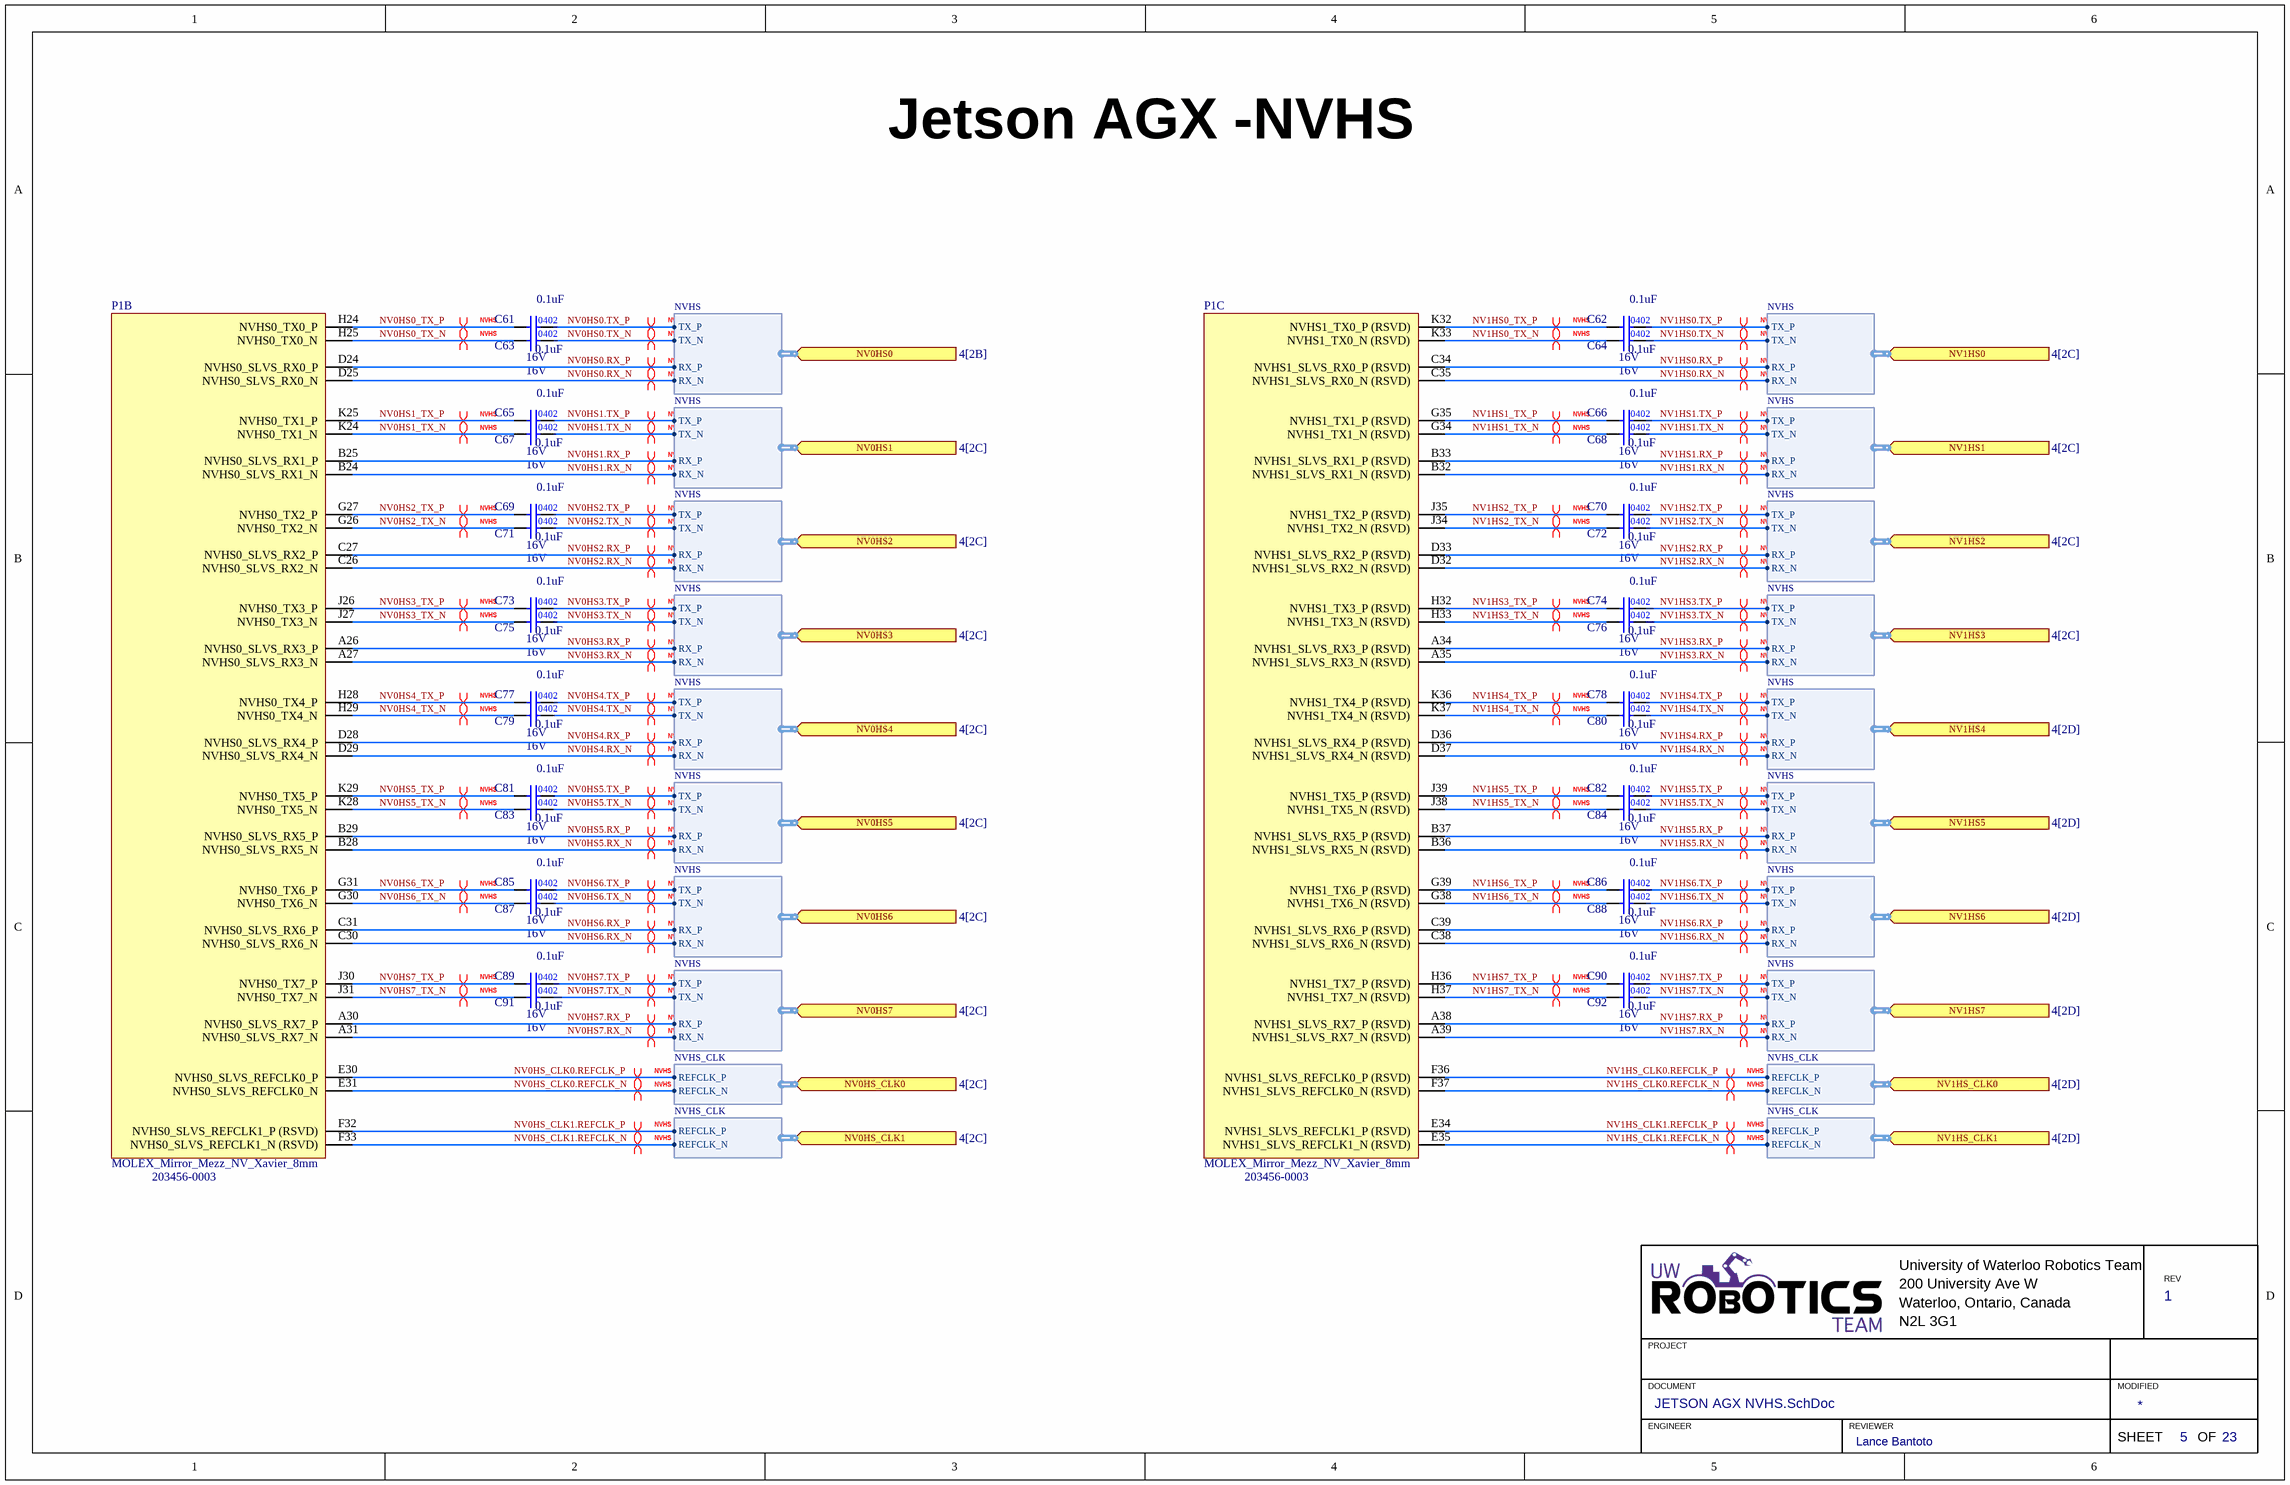
[diagram p17: JETSON AGX NVHS.SchDoc]

### Parts
C61  Capacitance: 0.1uF  Voltage Rating: 16V  [CAP0402]  (hidden comment: CAP_0.1uF_16V_X7R_0402)
C62  Capacitance: 0.1uF  Voltage Rating: 16V  [CAP0402]  (hidden comment: CAP_0.1uF_16V_X7R_0402)
C63  Capacitance: 0.1uF  Voltage Rating: 16V  [CAP0402]  (hidden comment: CAP_0.1uF_16V_X7R_0402)
C64  Capacitance: 0.1uF  Voltage Rating: 16V  [CAP0402]  (hidden comment: CAP_0.1uF_16V_X7R_0402)
C65  Capacitance: 0.1uF  Voltage Rating: 16V  [CAP0402]  (hidden comment: CAP_0.1uF_16V_X7R_0402)
C66  Capacitance: 0.1uF  Voltage Rating: 16V  [CAP0402]  (hidden comment: CAP_0.1uF_16V_X7R_0402)
C67  Capacitance: 0.1uF  Voltage Rating: 16V  [CAP0402]  (hidden comment: CAP_0.1uF_16V_X7R_0402)
C68  Capacitance: 0.1uF  Voltage Rating: 16V  [CAP0402]  (hidden comment: CAP_0.1uF_16V_X7R_0402)
C69  Capacitance: 0.1uF  Voltage Rating: 16V  [CAP0402]  (hidden comment: CAP_0.1uF_16V_X7R_0402)
C70  Capacitance: 0.1uF  Voltage Rating: 16V  [CAP0402]  (hidden comment: CAP_0.1uF_16V_X7R_0402)
C71  Capacitance: 0.1uF  Voltage Rating: 16V  [CAP0402]  (hidden comment: CAP_0.1uF_16V_X7R_0402)
C72  Capacitance: 0.1uF  Voltage Rating: 16V  [CAP0402]  (hidden comment: CAP_0.1uF_16V_X7R_0402)
C73  Capacitance: 0.1uF  Voltage Rating: 16V  [CAP0402]  (hidden comment: CAP_0.1uF_16V_X7R_0402)
C74  Capacitance: 0.1uF  Voltage Rating: 16V  [CAP0402]  (hidden comment: CAP_0.1uF_16V_X7R_0402)
C75  Capacitance: 0.1uF  Voltage Rating: 16V  [CAP0402]  (hidden comment: CAP_0.1uF_16V_X7R_0402)
C76  Capacitance: 0.1uF  Voltage Rating: 16V  [CAP0402]  (hidden comment: CAP_0.1uF_16V_X7R_0402)
C77  Capacitance: 0.1uF  Voltage Rating: 16V  [CAP0402]  (hidden comment: CAP_0.1uF_16V_X7R_0402)
C78  Capacitance: 0.1uF  Voltage Rating: 16V  [CAP0402]  (hidden comment: CAP_0.1uF_16V_X7R_0402)
C79  Capacitance: 0.1uF  Voltage Rating: 16V  [CAP0402]  (hidden comment: CAP_0.1uF_16V_X7R_0402)
C80  Capacitance: 0.1uF  Voltage Rating: 16V  [CAP0402]  (hidden comment: CAP_0.1uF_16V_X7R_0402)
C81  Capacitance: 0.1uF  Voltage Rating: 16V  [CAP0402]  (hidden comment: CAP_0.1uF_16V_X7R_0402)
C82  Capacitance: 0.1uF  Voltage Rating: 16V  [CAP0402]  (hidden comment: CAP_0.1uF_16V_X7R_0402)
C83  Capacitance: 0.1uF  Voltage Rating: 16V  [CAP0402]  (hidden comment: CAP_0.1uF_16V_X7R_0402)
C84  Capacitance: 0.1uF  Voltage Rating: 16V  [CAP0402]  (hidden comment: CAP_0.1uF_16V_X7R_0402)
C85  Capacitance: 0.1uF  Voltage Rating: 16V  [CAP0402]  (hidden comment: CAP_0.1uF_16V_X7R_0402)
C86  Capacitance: 0.1uF  Voltage Rating: 16V  [CAP0402]  (hidden comment: CAP_0.1uF_16V_X7R_0402)
C87  Capacitance: 0.1uF  Voltage Rating: 16V  [CAP0402]  (hidden comment: CAP_0.1uF_16V_X7R_0402)
C88  Capacitance: 0.1uF  Voltage Rating: 16V  [CAP0402]  (hidden comment: CAP_0.1uF_16V_X7R_0402)
C89  Capacitance: 0.1uF  Voltage Rating: 16V  [CAP0402]  (hidden comment: CAP_0.1uF_16V_X7R_0402)
C90  Capacitance: 0.1uF  Voltage Rating: 16V  [CAP0402]  (hidden comment: CAP_0.1uF_16V_X7R_0402)
C91  Capacitance: 0.1uF  Voltage Rating: 16V  [CAP0402]  (hidden comment: CAP_0.1uF_16V_X7R_0402)
C92  Capacitance: 0.1uF  Voltage Rating: 16V  [CAP0402]  (hidden comment: CAP_0.1uF_16V_X7R_0402)
P1  MOLEX_Mirror_Mezz_NV_Xavier_8mm  [203456-0003]  (parts B,C of 15)

### Ports
NV0HS0 (in, harness NVHS, see 4[2B]), NV0HS1 (in, harness NVHS, see 4[2C]), NV0HS2 (in, harness NVHS, see 4[2C]), NV0HS3 (in, harness NVHS, see 4[2C]), NV0HS4 (in, harness NVHS, see 4[2C]), NV0HS5 (in, harness NVHS, see 4[2C]), NV0HS6 (in, harness NVHS, see 4[2C]), NV0HS7 (in, harness NVHS, see 4[2C]), NV0HS_CLK0 (in, harness NVHS_CLK, see 4[2C]), NV0HS_CLK1 (in, harness NVHS_CLK, see 4[2C]), NV1HS0 (in, harness NVHS, see 4[2C]), NV1HS1 (in, harness NVHS, see 4[2C]), NV1HS2 (in, harness NVHS, see 4[2C]), NV1HS3 (in, harness NVHS, see 4[2C]), NV1HS4 (in, harness NVHS, see 4[2D]), NV1HS5 (in, harness NVHS, see 4[2D]), NV1HS6 (in, harness NVHS, see 4[2D]), NV1HS7 (in, harness NVHS, see 4[2D]), NV1HS_CLK0 (in, harness NVHS_CLK, see 4[2D]), NV1HS_CLK1 (in, harness NVHS_CLK, see 4[2D])

### Harnesses
NVHS: TX_P, TX_N, RX_P, RX_N
NVHS_CLK: REFCLK_P, REFCLK_N

### Nets
NV0HS0.RX_N: P1.D25(NVHS0_SLVS_RX0_N) ; port NV0HS0.RX_N
NV0HS0.RX_P: P1.D24(NVHS0_SLVS_RX0_P) ; port NV0HS0.RX_P
NV0HS0.TX_N: C63.2 ; port NV0HS0.TX_N
NV0HS0.TX_P: C61.2 ; port NV0HS0.TX_P
NV0HS0_TX_N: C63.1 P1.H25(NVHS0_TX0_N)
NV0HS0_TX_P: C61.1 P1.H24(NVHS0_TX0_P)
NV0HS1.RX_N: P1.B24(NVHS0_SLVS_RX1_N) ; port NV0HS1.RX_N
NV0HS1.RX_P: P1.B25(NVHS0_SLVS_RX1_P) ; port NV0HS1.RX_P
NV0HS1.TX_N: C67.2 ; port NV0HS1.TX_N
NV0HS1.TX_P: C65.2 ; port NV0HS1.TX_P
NV0HS1_TX_N: C67.1 P1.K24(NVHS0_TX1_N)
NV0HS1_TX_P: C65.1 P1.K25(NVHS0_TX1_P)
NV0HS2.RX_N: P1.C26(NVHS0_SLVS_RX2_N) ; port NV0HS2.RX_N
NV0HS2.RX_P: P1.C27(NVHS0_SLVS_RX2_P) ; port NV0HS2.RX_P
NV0HS2.TX_N: C71.2 ; port NV0HS2.TX_N
NV0HS2.TX_P: C69.2 ; port NV0HS2.TX_P
NV0HS2_TX_N: C71.1 P1.G26(NVHS0_TX2_N)
NV0HS2_TX_P: C69.1 P1.G27(NVHS0_TX2_P)
NV0HS3.RX_N: P1.A27(NVHS0_SLVS_RX3_N) ; port NV0HS3.RX_N
NV0HS3.RX_P: P1.A26(NVHS0_SLVS_RX3_P) ; port NV0HS3.RX_P
NV0HS3.TX_N: C75.2 ; port NV0HS3.TX_N
NV0HS3.TX_P: C73.2 ; port NV0HS3.TX_P
NV0HS3_TX_N: C75.1 P1.J27(NVHS0_TX3_N)
NV0HS3_TX_P: C73.1 P1.J26(NVHS0_TX3_P)
NV0HS4.RX_N: P1.D29(NVHS0_SLVS_RX4_N) ; port NV0HS4.RX_N
NV0HS4.RX_P: P1.D28(NVHS0_SLVS_RX4_P) ; port NV0HS4.RX_P
NV0HS4.TX_N: C79.2 ; port NV0HS4.TX_N
NV0HS4.TX_P: C77.2 ; port NV0HS4.TX_P
NV0HS4_TX_N: C79.1 P1.H29(NVHS0_TX4_N)
NV0HS4_TX_P: C77.1 P1.H28(NVHS0_TX4_P)
NV0HS5.RX_N: P1.B28(NVHS0_SLVS_RX5_N) ; port NV0HS5.RX_N
NV0HS5.RX_P: P1.B29(NVHS0_SLVS_RX5_P) ; port NV0HS5.RX_P
NV0HS5.TX_N: C83.2 ; port NV0HS5.TX_N
NV0HS5.TX_P: C81.2 ; port NV0HS5.TX_P
NV0HS5_TX_N: C83.1 P1.K28(NVHS0_TX5_N)
NV0HS5_TX_P: C81.1 P1.K29(NVHS0_TX5_P)
NV0HS6.RX_N: P1.C30(NVHS0_SLVS_RX6_N) ; port NV0HS6.RX_N
NV0HS6.RX_P: P1.C31(NVHS0_SLVS_RX6_P) ; port NV0HS6.RX_P
NV0HS6.TX_N: C87.2 ; port NV0HS6.TX_N
NV0HS6.TX_P: C85.2 ; port NV0HS6.TX_P
NV0HS6_TX_N: C87.1 P1.G30(NVHS0_TX6_N)
NV0HS6_TX_P: C85.1 P1.G31(NVHS0_TX6_P)
NV0HS7.RX_N: P1.A31(NVHS0_SLVS_RX7_N) ; port NV0HS7.RX_N
NV0HS7.RX_P: P1.A30(NVHS0_SLVS_RX7_P) ; port NV0HS7.RX_P
NV0HS7.TX_N: C91.2 ; port NV0HS7.TX_N
NV0HS7.TX_P: C89.2 ; port NV0HS7.TX_P
NV0HS7_TX_N: C91.1 P1.J31(NVHS0_TX7_N)
NV0HS7_TX_P: C89.1 P1.J30(NVHS0_TX7_P)
NV0HS_CLK0.REFCLK_N: P1.E31(NVHS0_SLVS_REFCLK0_N) ; port NV0HS_CLK0.REFCLK_N
NV0HS_CLK0.REFCLK_P: P1.E30(NVHS0_SLVS_REFCLK0_P) ; port NV0HS_CLK0.REFCLK_P
NV0HS_CLK1.REFCLK_N: P1.F33(NVHS0_SLVS_REFCLK1_N_(RSVD)) ; port NV0HS_CLK1.REFCLK_N
NV0HS_CLK1.REFCLK_P: P1.F32(NVHS0_SLVS_REFCLK1_P_(RSVD)) ; port NV0HS_CLK1.REFCLK_P
NV1HS0.RX_N: P1.C35(NVHS1_SLVS_RX0_N_(RSVD)) ; port NV1HS0.RX_N
NV1HS0.RX_P: P1.C34(NVHS1_SLVS_RX0_P_(RSVD)) ; port NV1HS0.RX_P
NV1HS0.TX_N: C64.2 ; port NV1HS0.TX_N
NV1HS0.TX_P: C62.2 ; port NV1HS0.TX_P
NV1HS0_TX_N: C64.1 P1.K33(NVHS1_TX0_N_(RSVD))
NV1HS0_TX_P: C62.1 P1.K32(NVHS1_TX0_P_(RSVD))
NV1HS1.RX_N: P1.B32(NVHS1_SLVS_RX1_N_(RSVD)) ; port NV1HS1.RX_N
NV1HS1.RX_P: P1.B33(NVHS1_SLVS_RX1_P_(RSVD)) ; port NV1HS1.RX_P
NV1HS1.TX_N: C68.2 ; port NV1HS1.TX_N
NV1HS1.TX_P: C66.2 ; port NV1HS1.TX_P
NV1HS1_TX_N: C68.1 P1.G34(NVHS1_TX1_N_(RSVD))
NV1HS1_TX_P: C66.1 P1.G35(NVHS1_TX1_P_(RSVD))
NV1HS2.RX_N: P1.D32(NVHS1_SLVS_RX2_N_(RSVD)) ; port NV1HS2.RX_N
NV1HS2.RX_P: P1.D33(NVHS1_SLVS_RX2_P_(RSVD)) ; port NV1HS2.RX_P
NV1HS2.TX_N: C72.2 ; port NV1HS2.TX_N
NV1HS2.TX_P: C70.2 ; port NV1HS2.TX_P
NV1HS2_TX_N: C72.1 P1.J34(NVHS1_TX2_N_(RSVD))
NV1HS2_TX_P: C70.1 P1.J35(NVHS1_TX2_P_(RSVD))
NV1HS3.RX_N: P1.A35(NVHS1_SLVS_RX3_N_(RSVD)) ; port NV1HS3.RX_N
NV1HS3.RX_P: P1.A34(NVHS1_SLVS_RX3_P_(RSVD)) ; port NV1HS3.RX_P
NV1HS3.TX_N: C76.2 ; port NV1HS3.TX_N
NV1HS3.TX_P: C74.2 ; port NV1HS3.TX_P
NV1HS3_TX_N: C76.1 P1.H33(NVHS1_TX3_N_(RSVD))
NV1HS3_TX_P: C74.1 P1.H32(NVHS1_TX3_P_(RSVD))
NV1HS4.RX_N: P1.D37(NVHS1_SLVS_RX4_N_(RSVD)) ; port NV1HS4.RX_N
NV1HS4.RX_P: P1.D36(NVHS1_SLVS_RX4_P_(RSVD)) ; port NV1HS4.RX_P
NV1HS4.TX_N: C80.2 ; port NV1HS4.TX_N
NV1HS4.TX_P: C78.2 ; port NV1HS4.TX_P
NV1HS4_TX_N: C80.1 P1.K37(NVHS1_TX4_N_(RSVD))
NV1HS4_TX_P: C78.1 P1.K36(NVHS1_TX4_P_(RSVD))
NV1HS5.RX_N: P1.B36(NVHS1_SLVS_RX5_N_(RSVD)) ; port NV1HS5.RX_N
NV1HS5.RX_P: P1.B37(NVHS1_SLVS_RX5_P_(RSVD)) ; port NV1HS5.RX_P
NV1HS5.TX_N: C84.2 ; port NV1HS5.TX_N
NV1HS5.TX_P: C82.2 ; port NV1HS5.TX_P
NV1HS5_TX_N: C84.1 P1.J38(NVHS1_TX5_N_(RSVD))
NV1HS5_TX_P: C82.1 P1.J39(NVHS1_TX5_P_(RSVD))
NV1HS6.RX_N: P1.C38(NVHS1_SLVS_RX6_N_(RSVD)) ; port NV1HS6.RX_N
NV1HS6.RX_P: P1.C39(NVHS1_SLVS_RX6_P_(RSVD)) ; port NV1HS6.RX_P
NV1HS6.TX_N: C88.2 ; port NV1HS6.TX_N
NV1HS6.TX_P: C86.2 ; port NV1HS6.TX_P
NV1HS6_TX_N: C88.1 P1.G38(NVHS1_TX6_N_(RSVD))
NV1HS6_TX_P: C86.1 P1.G39(NVHS1_TX6_P_(RSVD))
NV1HS7.RX_N: P1.A39(NVHS1_SLVS_RX7_N_(RSVD)) ; port NV1HS7.RX_N
NV1HS7.RX_P: P1.A38(NVHS1_SLVS_RX7_P_(RSVD)) ; port NV1HS7.RX_P
NV1HS7.TX_N: C92.2 ; port NV1HS7.TX_N
NV1HS7.TX_P: C90.2 ; port NV1HS7.TX_P
NV1HS7_TX_N: C92.1 P1.H37(NVHS1_TX7_N_(RSVD))
NV1HS7_TX_P: C90.1 P1.H36(NVHS1_TX7_P_(RSVD))
NV1HS_CLK0.REFCLK_N: P1.F37(NVHS1_SLVS_REFCLK0_N_(RSVD)) ; port NV1HS_CLK0.REFCLK_N
NV1HS_CLK0.REFCLK_P: P1.F36(NVHS1_SLVS_REFCLK0_P_(RSVD)) ; port NV1HS_CLK0.REFCLK_P
NV1HS_CLK1.REFCLK_N: P1.E35(NVHS1_SLVS_REFCLK1_N_(RSVD)) ; port NV1HS_CLK1.REFCLK_N
NV1HS_CLK1.REFCLK_P: P1.E34(NVHS1_SLVS_REFCLK1_P_(RSVD)) ; port NV1HS_CLK1.REFCLK_P

### Layout directives
differential pair; differential pair class NVHS; differential pair class NV0HS_CLK0; differential pair class NVHS_CLK: NV0HS_CLK0.REFCLK_N, NV0HS_CLK0.REFCLK_P
differential pair; differential pair class NVHS; differential pair class NV0HS_CLK1; differential pair class NVHS_CLK: NV0HS_CLK1.REFCLK_N, NV0HS_CLK1.REFCLK_P
differential pair; differential pair class NVHS; differential pair class NV1HS_CLK0; differential pair class NVHS_CLK: NV1HS_CLK0.REFCLK_N, NV1HS_CLK0.REFCLK_P
differential pair; differential pair class NVHS; differential pair class NV1HS_CLK1; differential pair class NVHS_CLK: NV1HS_CLK1.REFCLK_N, NV1HS_CLK1.REFCLK_P
differential pair; differential pair class NVHS; differential pair class NV0HS0: NV0HS0.RX_N, NV0HS0.RX_P, NV0HS0.TX_N, NV0HS0.TX_P, NV0HS0_TX_N, NV0HS0_TX_P
differential pair; differential pair class NVHS; differential pair class NV0HS1: NV0HS1.RX_N, NV0HS1.RX_P, NV0HS1.TX_N, NV0HS1.TX_P, NV0HS1_TX_N, NV0HS1_TX_P
differential pair; differential pair class NVHS; differential pair class NV0HS2: NV0HS2.RX_N, NV0HS2.RX_P, NV0HS2.TX_N, NV0HS2.TX_P, NV0HS2_TX_N, NV0HS2_TX_P
differential pair; differential pair class NVHS; differential pair class NV0HS3: NV0HS3.RX_N, NV0HS3.RX_P, NV0HS3.TX_N, NV0HS3.TX_P, NV0HS3_TX_N, NV0HS3_TX_P
differential pair; differential pair class NVHS; differential pair class NV0HS4: NV0HS4.RX_N, NV0HS4.RX_P, NV0HS4.TX_N, NV0HS4.TX_P, NV0HS4_TX_N, NV0HS4_TX_P
differential pair; differential pair class NVHS; differential pair class NV0HS5: NV0HS5.RX_N, NV0HS5.RX_P, NV0HS5.TX_N, NV0HS5.TX_P, NV0HS5_TX_N, NV0HS5_TX_P
differential pair; differential pair class NVHS; differential pair class NV0HS6: NV0HS6.RX_N, NV0HS6.RX_P, NV0HS6.TX_N, NV0HS6.TX_P, NV0HS6_TX_N, NV0HS6_TX_P
differential pair; differential pair class NVHS; differential pair class NV0HS7: NV0HS7.RX_N, NV0HS7.RX_P, NV0HS7.TX_N, NV0HS7.TX_P, NV0HS7_TX_N, NV0HS7_TX_P
differential pair; differential pair class NVHS; differential pair class NV1HS0: NV1HS0.RX_N, NV1HS0.RX_P, NV1HS0.TX_N, NV1HS0.TX_P, NV1HS0_TX_N, NV1HS0_TX_P
differential pair; differential pair class NVHS; differential pair class NV1HS1: NV1HS1.RX_N, NV1HS1.RX_P, NV1HS1.TX_N, NV1HS1.TX_P, NV1HS1_TX_N, NV1HS1_TX_P
differential pair; differential pair class NVHS; differential pair class NV1HS2: NV1HS2.RX_N, NV1HS2.RX_P, NV1HS2.TX_N, NV1HS2.TX_P, NV1HS2_TX_N, NV1HS2_TX_P
differential pair; differential pair class NVHS; differential pair class NV1HS3: NV1HS3.RX_N, NV1HS3.RX_P, NV1HS3.TX_N, NV1HS3.TX_P, NV1HS3_TX_N, NV1HS3_TX_P
differential pair; differential pair class NVHS; differential pair class NV1HS4: NV1HS4.RX_N, NV1HS4.RX_P, NV1HS4.TX_N, NV1HS4.TX_P, NV1HS4_TX_N, NV1HS4_TX_P
differential pair; differential pair class NVHS; differential pair class NV1HS5: NV1HS5.RX_N, NV1HS5.RX_P, NV1HS5.TX_N, NV1HS5.TX_P, NV1HS5_TX_N, NV1HS5_TX_P
differential pair; differential pair class NVHS; differential pair class NV1HS6: NV1HS6.RX_N, NV1HS6.RX_P, NV1HS6.TX_N, NV1HS6.TX_P, NV1HS6_TX_N, NV1HS6_TX_P
differential pair; differential pair class NVHS; differential pair class NV1HS7: NV1HS7.RX_N, NV1HS7.RX_P, NV1HS7.TX_N, NV1HS7.TX_P, NV1HS7_TX_N, NV1HS7_TX_P

### Notes on the sheet
- University of Waterloo Robotics Team
- 200 University Ave W
- REV
- PROJECT
- Waterloo, Ontario, Canada
- N2L 3G1
- DOCUMENT
- ENGINEER
- REVIEWER
- MODIFIED
- SHEET
- OF

### Library data of the parts
C61-C92 = CAP_0.1uF_16V_X7R_0402: CAP CER 0.1UF 16V X7R 0402; Supplier 1: Digi-Key; Mounting Type: Surface Mount; Package: 0402
P1 = MOLEX_Mirror_Mezz_NV_Xavier_8mm: as P1 on sheet JETSON AGX SDIO-SPI-UART-CAN-GPIO; Supplier 1: Digi-Key; Supplier Part Number 1: WM25528CT-ND; Manufacturer Part Number 1: 203456-0003

## Sheet JETSON AGX PCIE.SchDoc: Jetson AGX PCIe
size 279 x 215 mm; CheckedBy: Lance Bantoto; Engineer: Cindy Li, Chealsie Bains; DocumentNumber: 11; Revision: 1; SheetNumber: 11; SheetTotal: 23
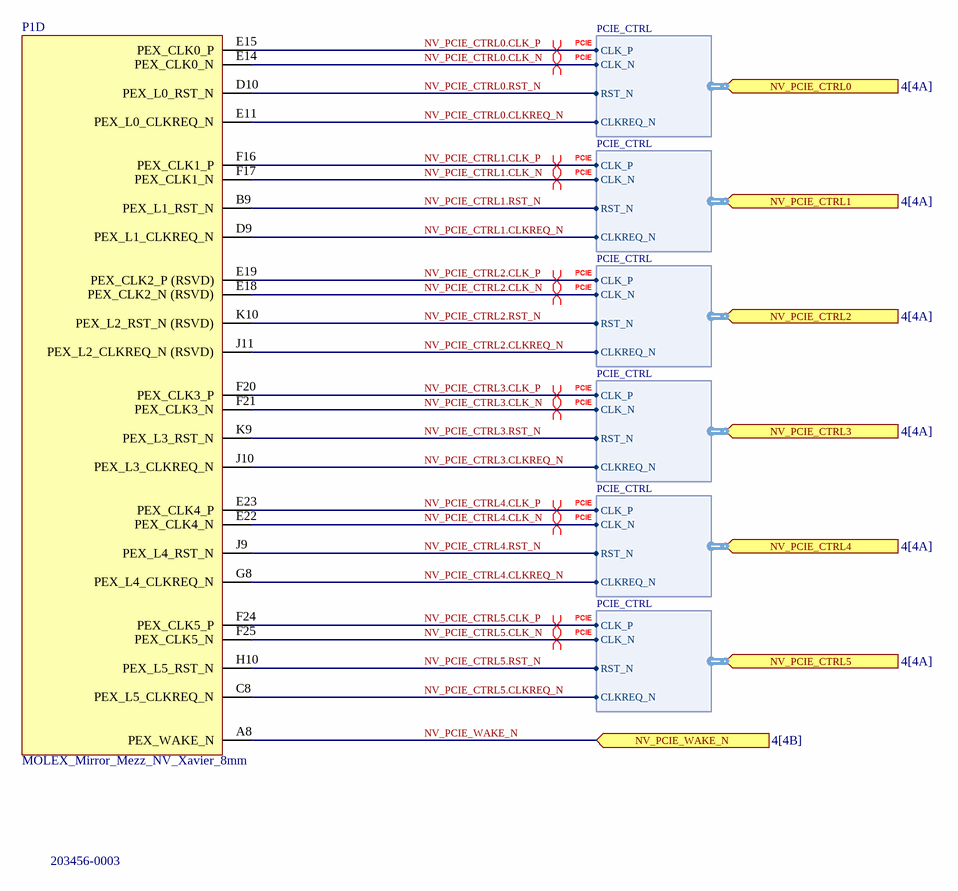
[diagram p18: JETSON AGX PCIE.SchDoc]

### Parts
P1  MOLEX_Mirror_Mezz_NV_Xavier_8mm  [203456-0003]  (part D of 15)

### Ports
NV_PCIE_CTRL0 (in, harness PCIE_CTRL, see 4[4A]), NV_PCIE_CTRL1 (in, harness PCIE_CTRL, see 4[4A]), NV_PCIE_CTRL2 (in, harness PCIE_CTRL, see 4[4A]), NV_PCIE_CTRL3 (in, harness PCIE_CTRL, see 4[4A]), NV_PCIE_CTRL4 (in, harness PCIE_CTRL, see 4[4A]), NV_PCIE_CTRL5 (in, harness PCIE_CTRL, see 4[4A]), NV_PCIE_WAKE_N (in, see 4[4B])

### Harnesses
PCIE_CTRL: CLK_P, CLK_N, RST_N, CLKREQ_N

### Nets
NV_PCIE_CTRL0.CLK_N: P1.E14(PEX_CLK0_N) ; port NV_PCIE_CTRL0.CLK_N
NV_PCIE_CTRL0.CLK_P: P1.E15(PEX_CLK0_P) ; port NV_PCIE_CTRL0.CLK_P
NV_PCIE_CTRL0.CLKREQ_N: P1.E11(PEX_L0_CLKREQ_N) ; port NV_PCIE_CTRL0.CLKREQ_N
NV_PCIE_CTRL0.RST_N: P1.D10(PEX_L0_RST_N) ; port NV_PCIE_CTRL0.RST_N
NV_PCIE_CTRL1.CLK_N: P1.F17(PEX_CLK1_N) ; port NV_PCIE_CTRL1.CLK_N
NV_PCIE_CTRL1.CLK_P: P1.F16(PEX_CLK1_P) ; port NV_PCIE_CTRL1.CLK_P
NV_PCIE_CTRL1.CLKREQ_N: P1.D9(PEX_L1_CLKREQ_N) ; port NV_PCIE_CTRL1.CLKREQ_N
NV_PCIE_CTRL1.RST_N: P1.B9(PEX_L1_RST_N) ; port NV_PCIE_CTRL1.RST_N
NV_PCIE_CTRL2.CLK_N: P1.E18(PEX_CLK2_N_(RSVD)) ; port NV_PCIE_CTRL2.CLK_N
NV_PCIE_CTRL2.CLK_P: P1.E19(PEX_CLK2_P_(RSVD)) ; port NV_PCIE_CTRL2.CLK_P
NV_PCIE_CTRL2.CLKREQ_N: P1.J11(PEX_L2_CLKREQ_N_(RSVD)) ; port NV_PCIE_CTRL2.CLKREQ_N
NV_PCIE_CTRL2.RST_N: P1.K10(PEX_L2_RST_N_(RSVD)) ; port NV_PCIE_CTRL2.RST_N
NV_PCIE_CTRL3.CLK_N: P1.F21(PEX_CLK3_N) ; port NV_PCIE_CTRL3.CLK_N
NV_PCIE_CTRL3.CLK_P: P1.F20(PEX_CLK3_P) ; port NV_PCIE_CTRL3.CLK_P
NV_PCIE_CTRL3.CLKREQ_N: P1.J10(PEX_L3_CLKREQ_N) ; port NV_PCIE_CTRL3.CLKREQ_N
NV_PCIE_CTRL3.RST_N: P1.K9(PEX_L3_RST_N) ; port NV_PCIE_CTRL3.RST_N
NV_PCIE_CTRL4.CLK_N: P1.E22(PEX_CLK4_N) ; port NV_PCIE_CTRL4.CLK_N
NV_PCIE_CTRL4.CLK_P: P1.E23(PEX_CLK4_P) ; port NV_PCIE_CTRL4.CLK_P
NV_PCIE_CTRL4.CLKREQ_N: P1.G8(PEX_L4_CLKREQ_N) ; port NV_PCIE_CTRL4.CLKREQ_N
NV_PCIE_CTRL4.RST_N: P1.J9(PEX_L4_RST_N) ; port NV_PCIE_CTRL4.RST_N
NV_PCIE_CTRL5.CLK_N: P1.F25(PEX_CLK5_N) ; port NV_PCIE_CTRL5.CLK_N
NV_PCIE_CTRL5.CLK_P: P1.F24(PEX_CLK5_P) ; port NV_PCIE_CTRL5.CLK_P
NV_PCIE_CTRL5.CLKREQ_N: P1.C8(PEX_L5_CLKREQ_N) ; port NV_PCIE_CTRL5.CLKREQ_N
NV_PCIE_CTRL5.RST_N: P1.H10(PEX_L5_RST_N) ; port NV_PCIE_CTRL5.RST_N
NV_PCIE_WAKE_N: P1.A8(PEX_WAKE_N) ; port NV_PCIE_WAKE_N

### Layout directives
differential pair; differential pair class PCIE; differential pair class PCIE_CLK0; differential pair class PCIE_CLK: NV_PCIE_CTRL0.CLK_N, NV_PCIE_CTRL0.CLK_P
differential pair; differential pair class PCIE; differential pair class PCIE_CLK1; differential pair class PCIE_CLK: NV_PCIE_CTRL1.CLK_N, NV_PCIE_CTRL1.CLK_P
differential pair; differential pair class PCIE; differential pair class PCIE_CLK2; differential pair class PCIE_CLK: NV_PCIE_CTRL2.CLK_N, NV_PCIE_CTRL2.CLK_P
differential pair; differential pair class PCIE; differential pair class PCIE_CLK3; differential pair class PCIE_CLK: NV_PCIE_CTRL3.CLK_N, NV_PCIE_CTRL3.CLK_P
differential pair; differential pair class PCIE; differential pair class PCIE_CLK4; differential pair class PCIE_CLK: NV_PCIE_CTRL4.CLK_N, NV_PCIE_CTRL4.CLK_P
differential pair; differential pair class PCIE; differential pair class PCIE_CLK5; differential pair class PCIE_CLK: NV_PCIE_CTRL5.CLK_N, NV_PCIE_CTRL5.CLK_P

### Notes on the sheet
- University of Waterloo Robotics Team
- 200 University Ave W
- REV
- PROJECT
- Waterloo, Ontario, Canada
- N2L 3G1
- DOCUMENT
- ENGINEER
- REVIEWER
- MODIFIED
- SHEET
- OF

### Library data of the parts
P1 = MOLEX_Mirror_Mezz_NV_Xavier_8mm: as P1 on sheet JETSON AGX SDIO-SPI-UART-CAN-GPIO; Supplier 1: Digi-Key; Supplier Part Number 1: WM25528CT-ND; Manufacturer Part Number 1: 203456-0003